# EasyEDA Pro project ProPrj_雁过留痕_2026-07-08.epro, schematic 

## Sheets
1 主控: Board Name: Board1; Create Date: 2025-12-18; Page Name: P1; Project Name: 雁过留痕第二版; Schematic Name: Schematic1; Update Date: 2025-12-22; Company: 嘉立创EDA; Page Size: A4; Version: V1.0
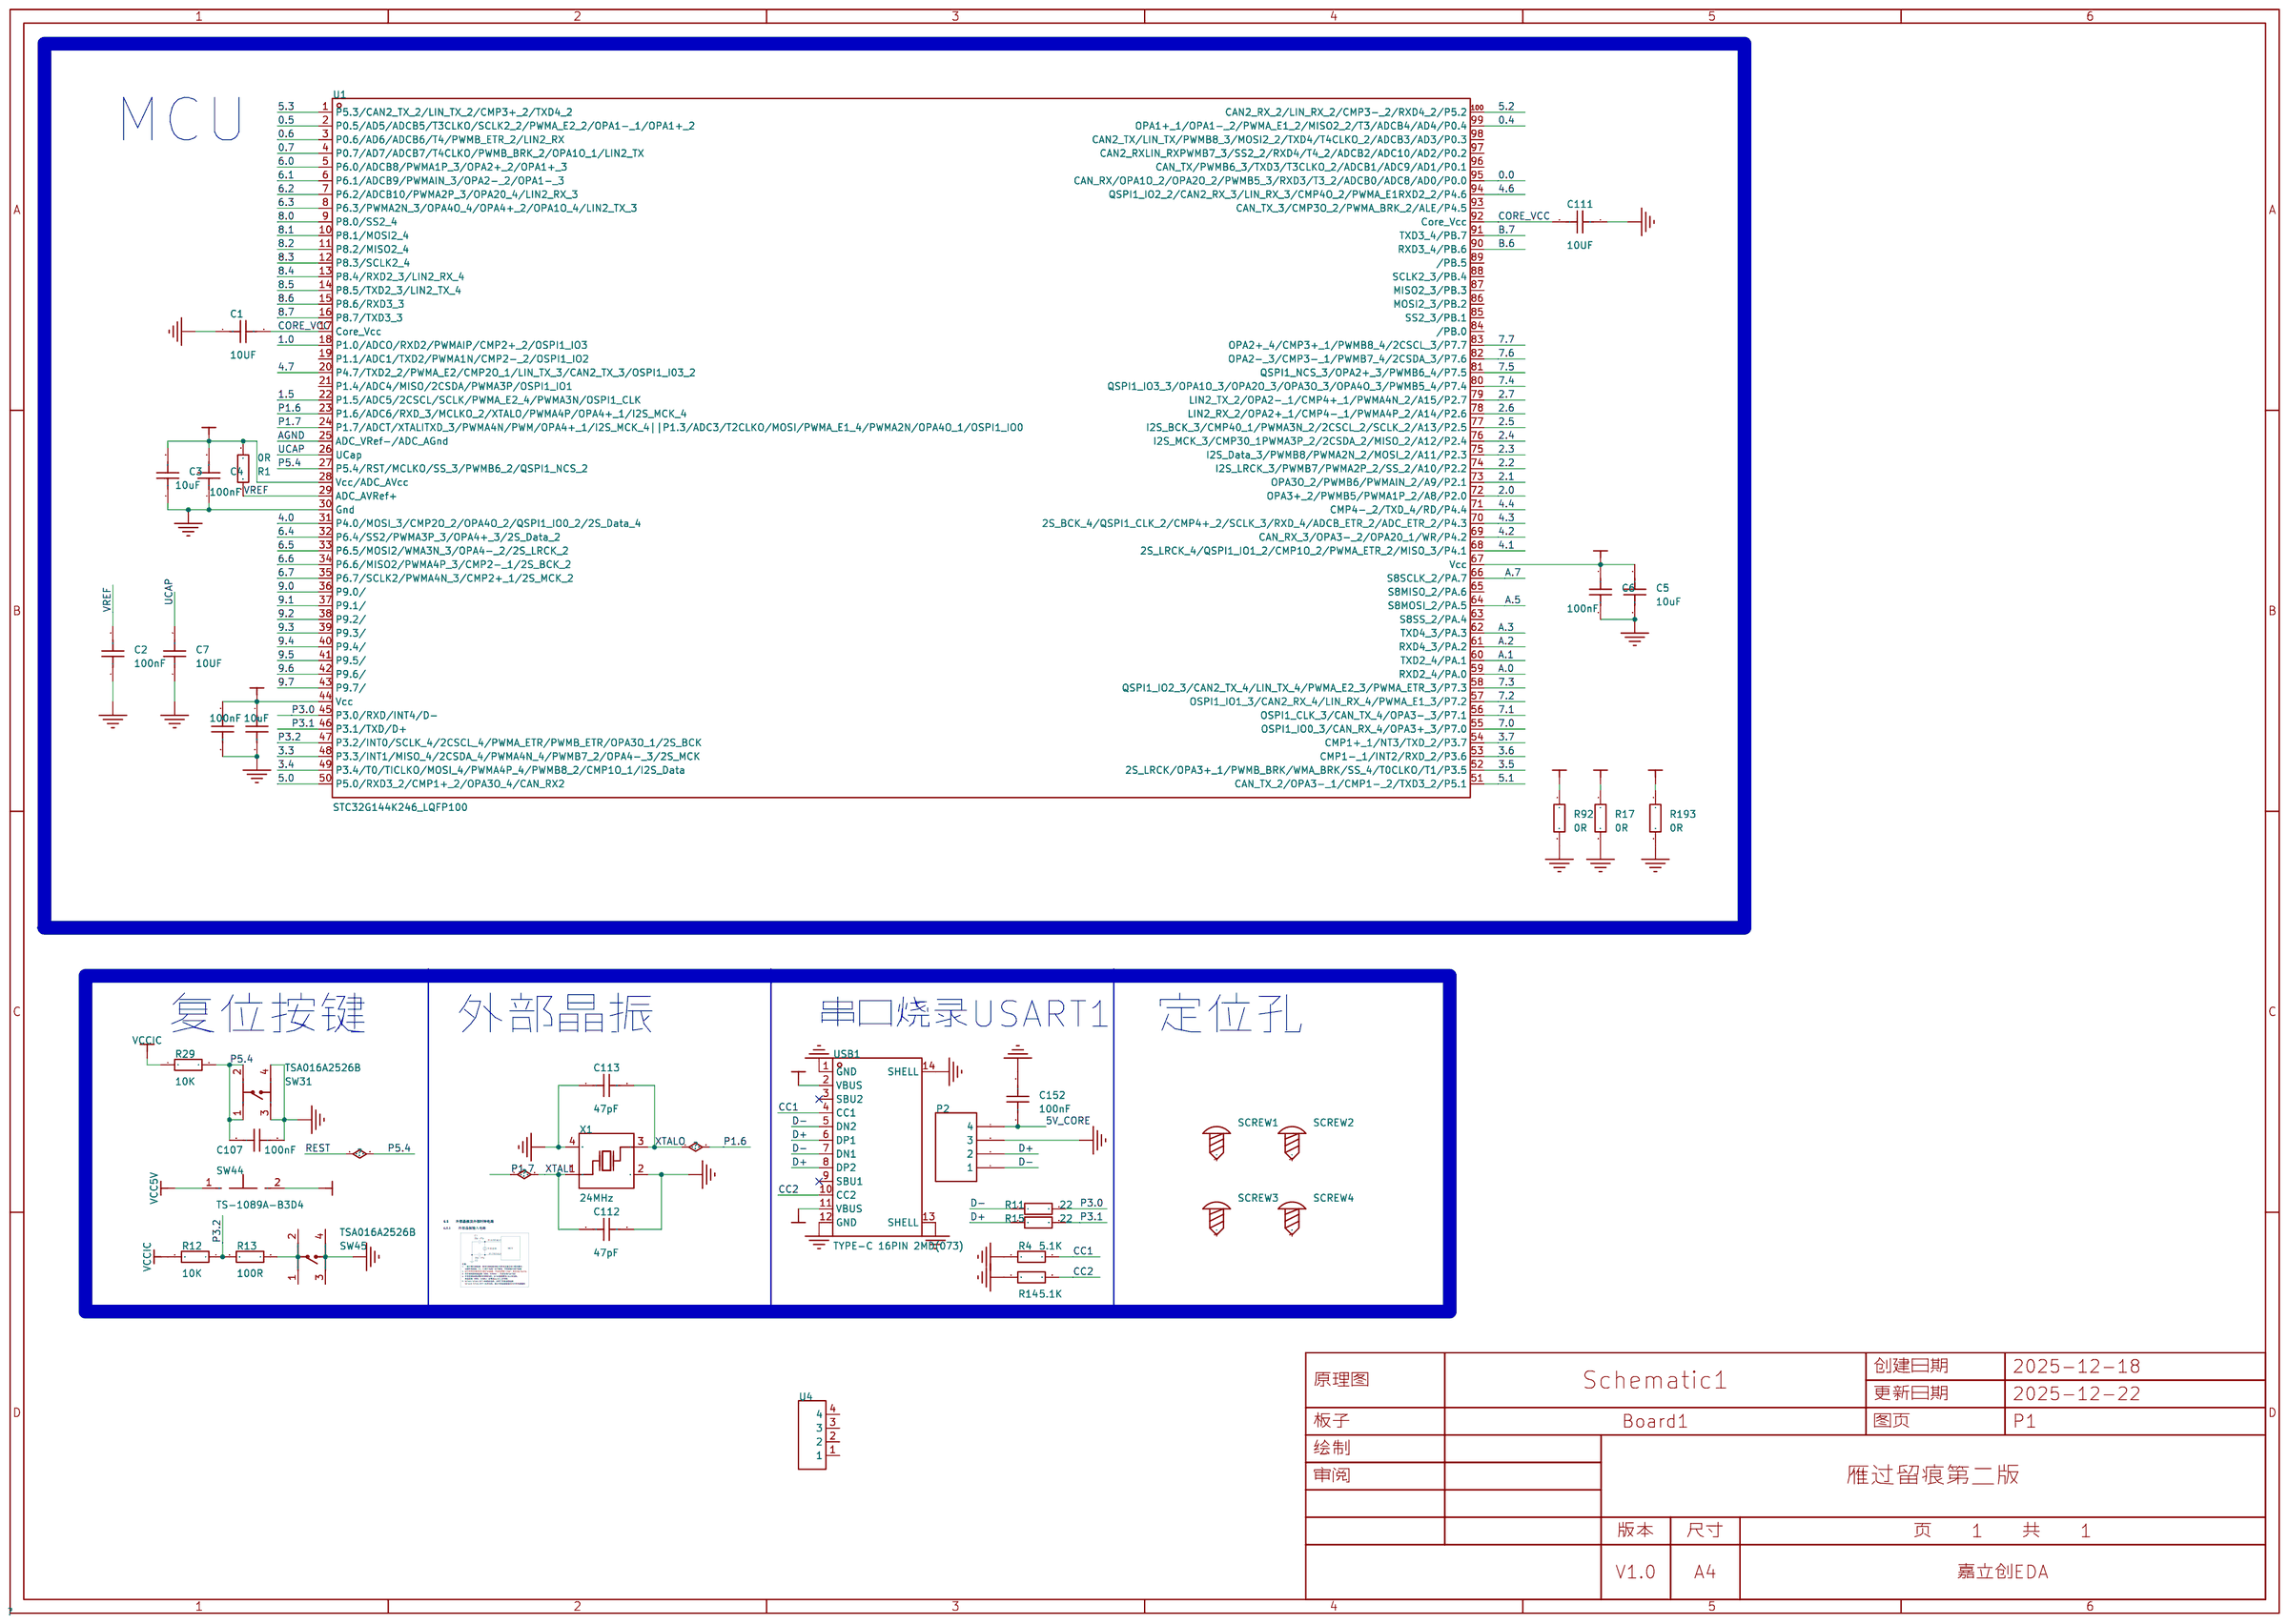
[diagram p0: 主控]
2 电源: Assembly Variant: Basic; Create Date: 2026-03-18; Page Name: P2; Project Name: 雁过留痕主驱一体_逐飞库; Update Date: 2026-03-18
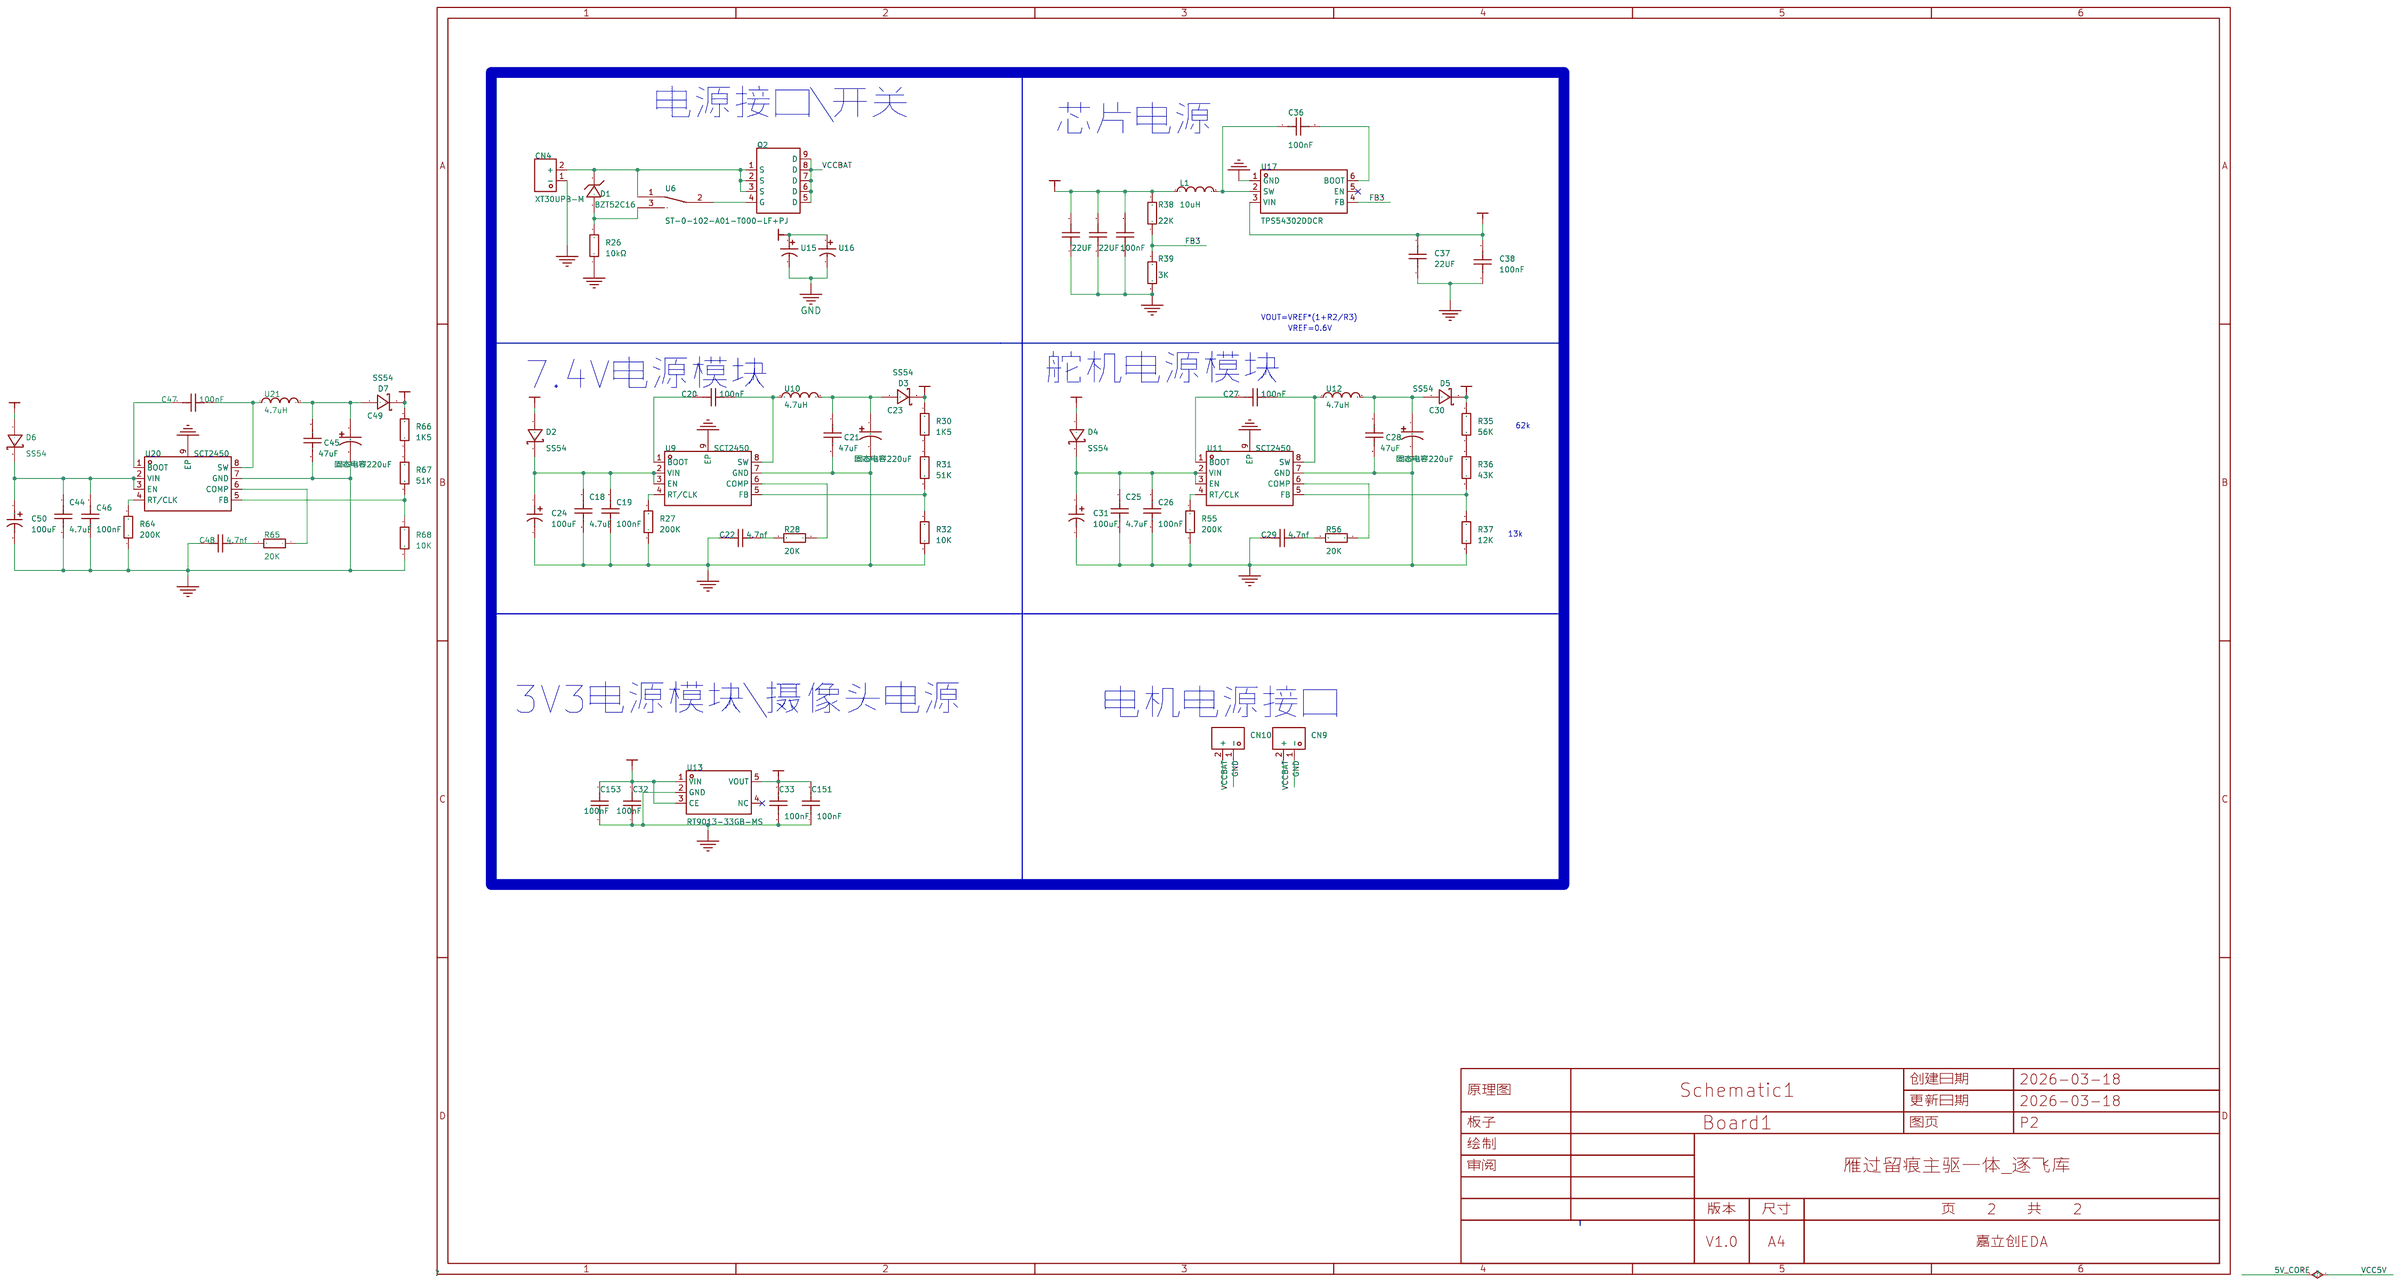
[diagram p1: 电源]
3 外设1: Assembly Variant: Basic; Create Date: 2026-03-18; Page Name: P3; Project Name: 雁过留痕主驱一体_逐飞库; Update Date: 2026-03-18
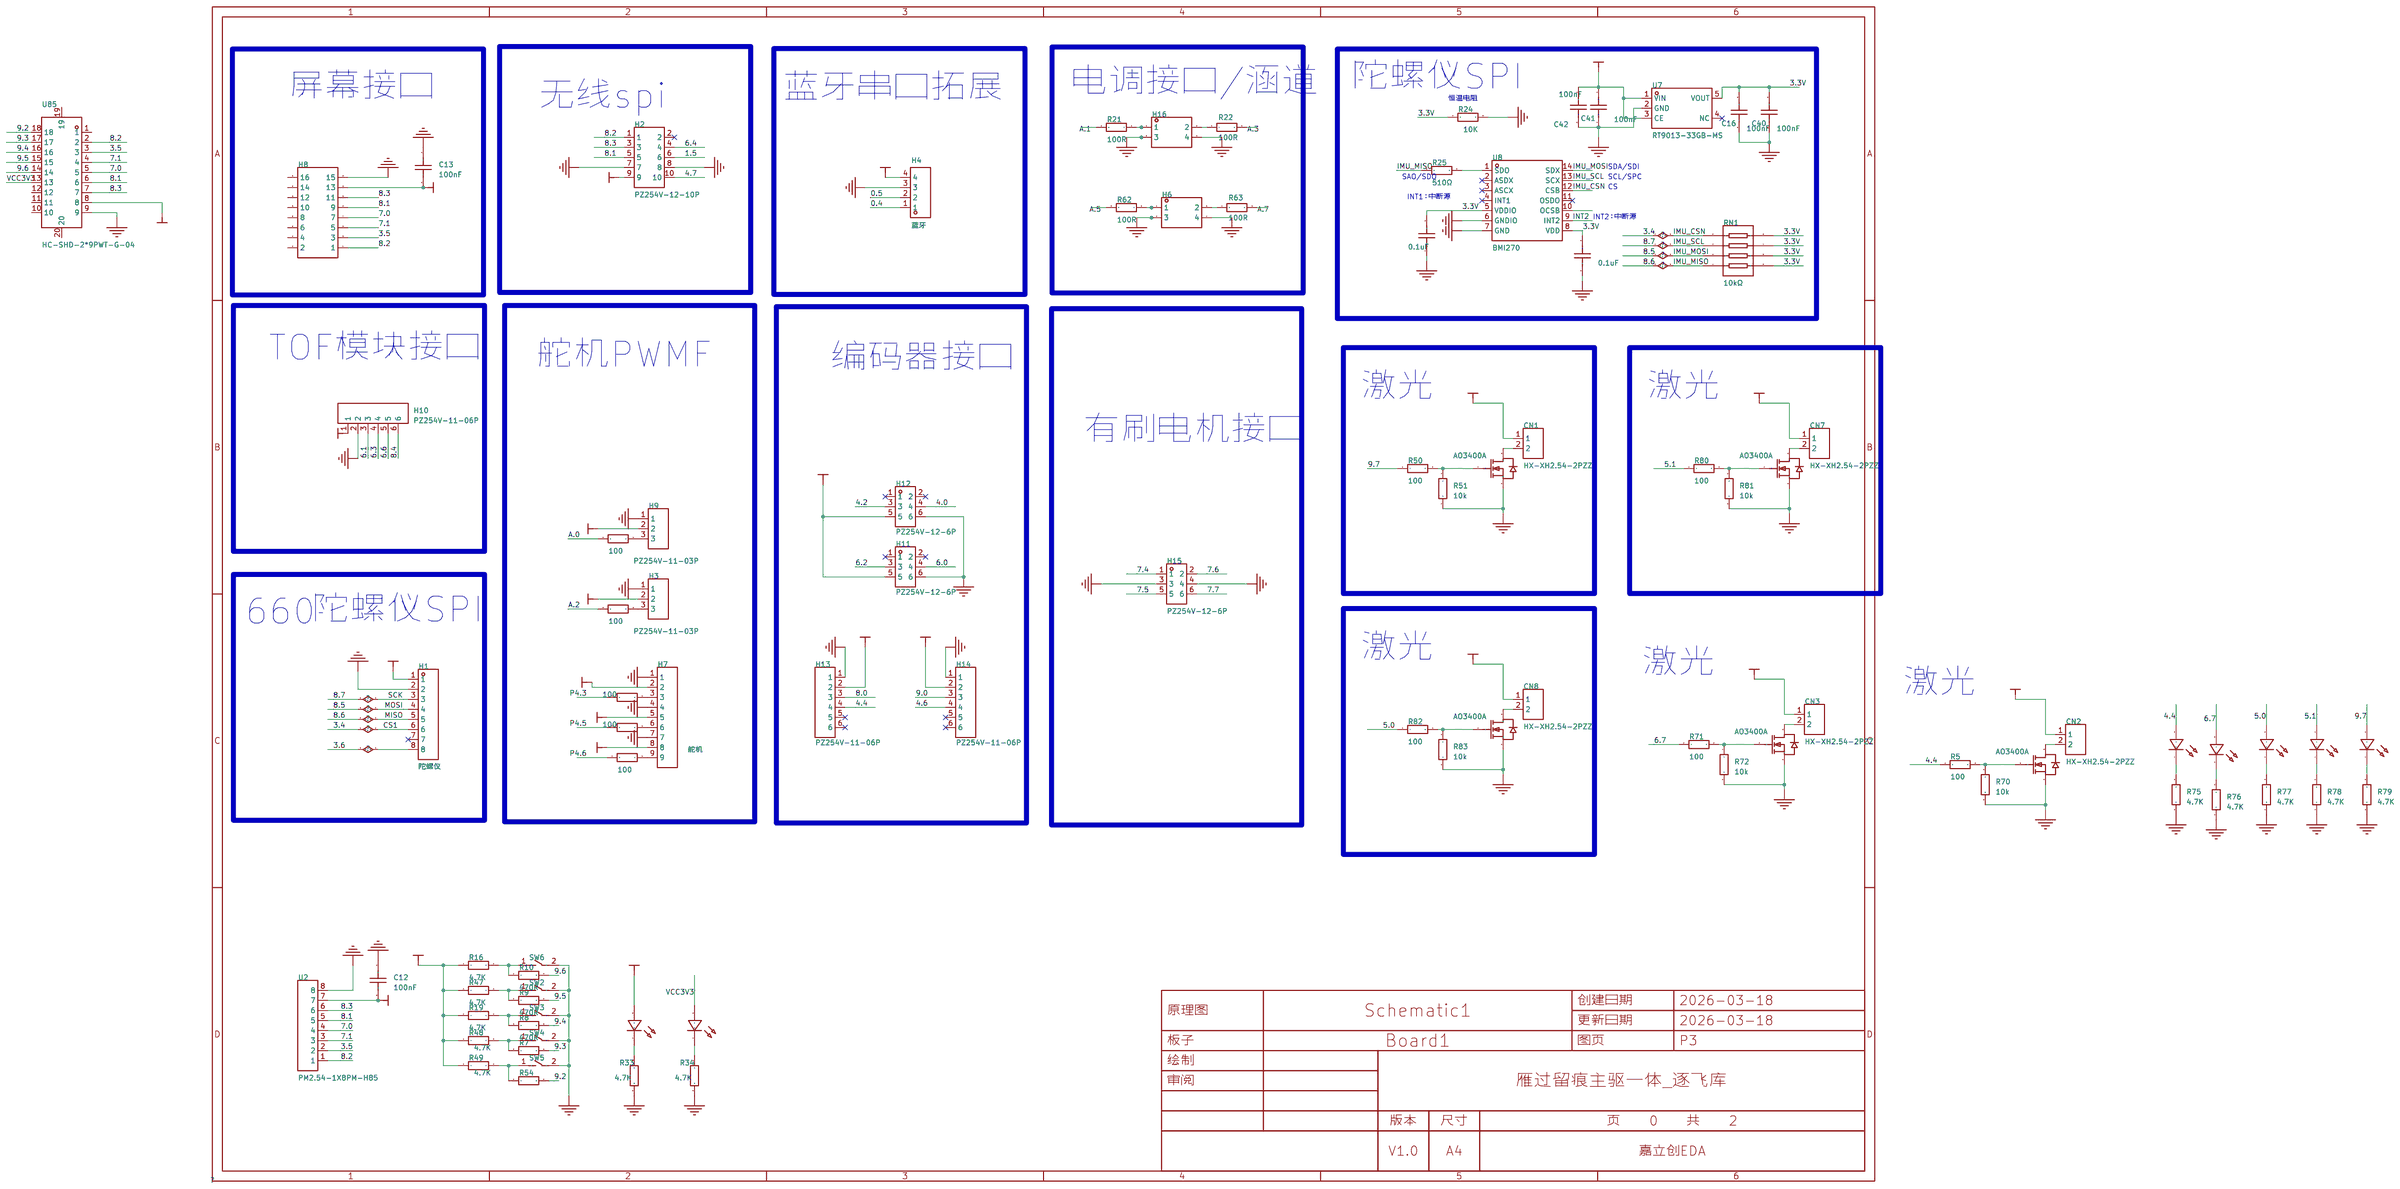
[diagram p2: 外设1]
4 外设2: Assembly Variant: Basic; Create Date: 2026-03-18; Page Name: P4; Project Name: 雁过留痕主驱一体_逐飞库; Update Date: 2026-03-18
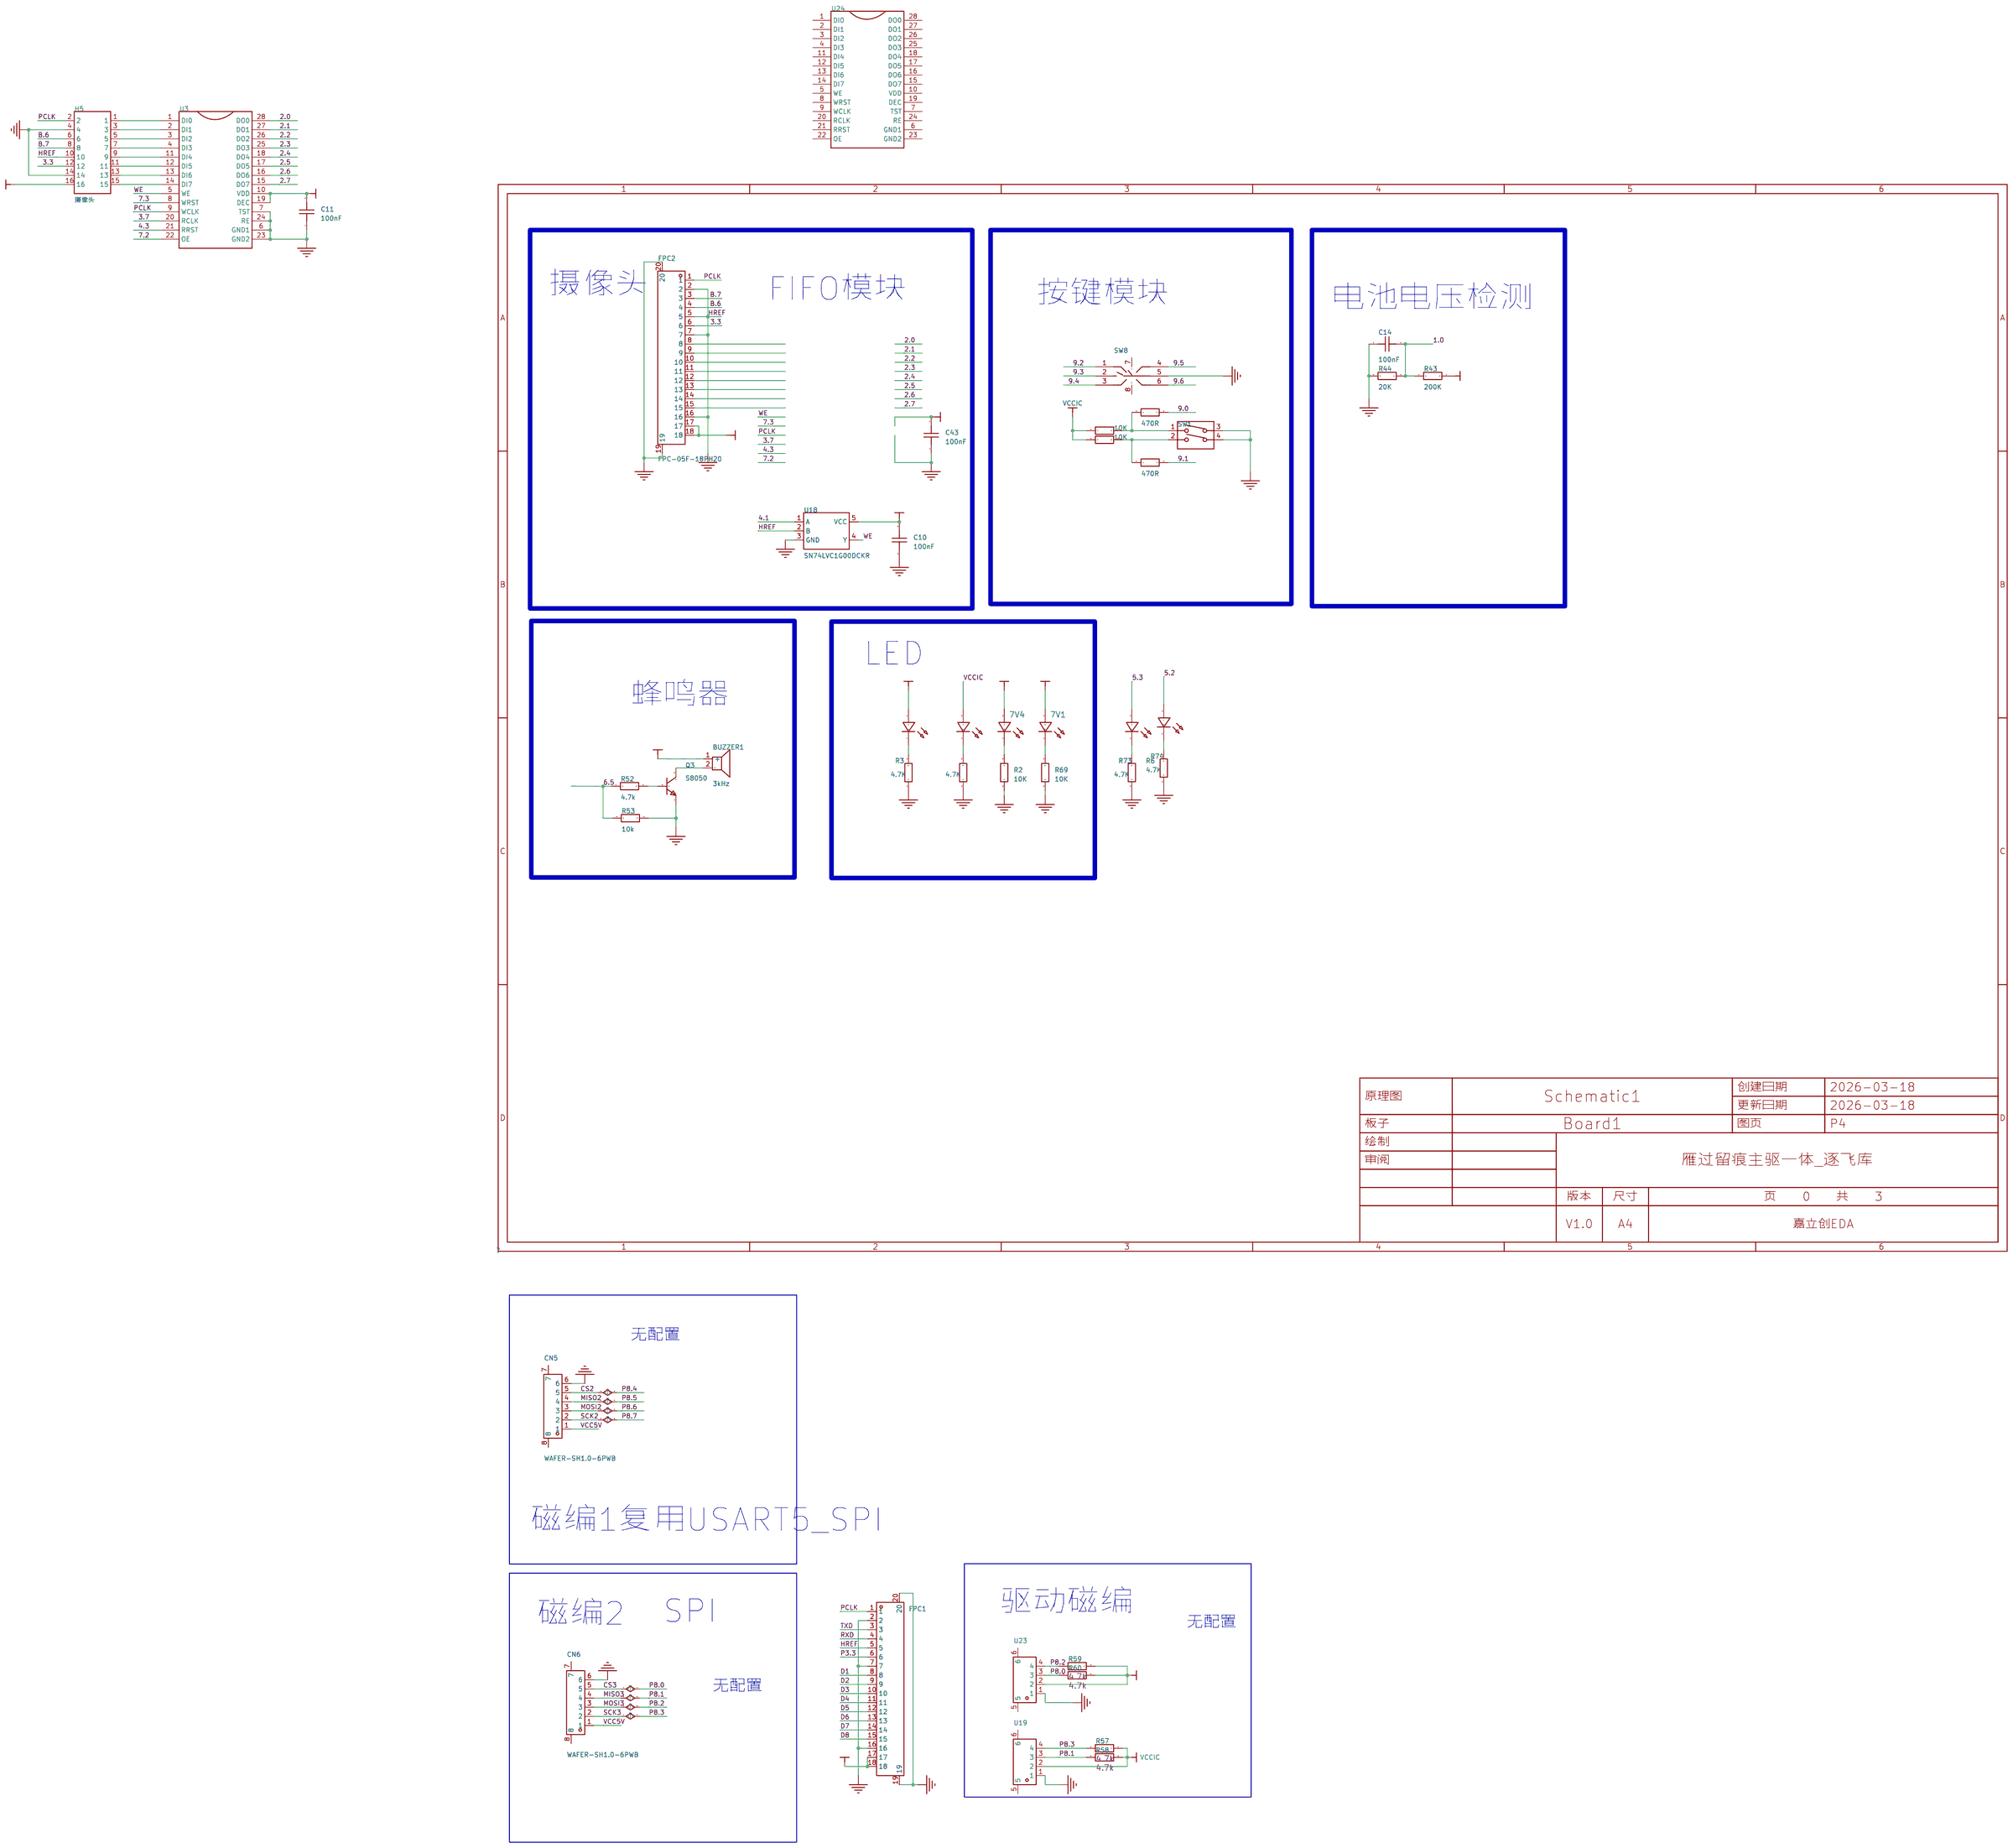
[diagram p3: 外设2]

## Parts
sheet 主控
C1  10UF  [C0603]
C2  100nF  [C0603]
C3  10uF  [C0603]
C4  100nF  [C0603]
C5  10uF  [C0603]
C6  100nF  [C0603]
C7  10UF  [C0603]
C8  10uF  [C0603]
C9  100nF  [C0603]
C107  100nF  [C0603_2]
C111  10UF  [C0603]
C112  100nF  [C0603_1]
C113  100nF  [C0603_1]
C152  100nF  [C0603_1]
P2  Header-D-M 1x4P  [HDR1X4-TP]
R1  0R  [R0603_3]
R4  10K  [R0603_9]
R11  22  [R0603]
R12  10K  [R0603_6]
R13  100R  [R0603_6]
R14  10K  [R0603_9]
R15  22  [R0603]
R17  0R  [R0603_3]
R29  10K  [R0603_5]
R92  0R  [R0603_3]
R193  0R  [R0603_3]
SCREW1  -  [M3螺丝]
SCREW2  -  [M3螺丝]
SCREW3  -  [M3螺丝]
SCREW4  -  [M3螺丝]
SW31  TSA016A2526B  [KEY-SMD_4P-L4.2-W3.4-P2.15-LS4.5-TL]
SW44  TS-1089A-B3D4  [KEY-SMD_2P-L6.0-W3.8-LS7.30-L]
SW45  TSA016A2526B  [KEY-SMD_4P-L4.2-W3.4-P2.15-LS4.5-TL]
U1  STC32G144K246_LQFP100  [STC32G144K246LQFP-100(16x16)]
U4  HX PZ2.54-1x4P WZ  [HDR-TH_4P-P2.54-H-M-W10.3]
USB1  TYPE-C 16PIN 2MD(073)  [USB-C-SMD_TYPE-C-6PIN-2MD-073]
X1  24MHz  [CRYSTAL-SMD_4P-L3.2-W2.5-BL]
sheet 外设1
3V2  -  [LED_0805]
3V3  -  [LED_0805]
3V4  -  [LED_0805]
3V5  -  [LED_0805]
3V6  -  [LED_0805]
3V7  -  [LED_0805]
3V8  -  [LED_0805]
C12  100nF  [C0603]
C13  100nF  [C0603]
C15  0.1uF  [C0402_3]
C16  100nF  [C0402_3]
C17  0.1uF  [C0402_3]
C40  100nF  [C0402_3]
C41  100nF  [C0402_3]
C42  100nF  [C0402_3]
CN1  HX-XH2.54-2PZZ  [CONN-TH_2P-P2.50_HX-2.54MM-2P-ZZ-MS]
CN2  HX-XH2.54-2PZZ  [CONN-TH_2P-P2.50_HX-2.54MM-2P-ZZ-MS]
CN3  HX-XH2.54-2PZZ  [CONN-TH_2P-P2.50_HX-2.54MM-2P-ZZ-MS]
CN7  HX-XH2.54-2PZZ  [CONN-TH_2P-P2.50_HX-2.54MM-2P-ZZ-MS]
CN8  HX-XH2.54-2PZZ  [CONN-TH_2P-P2.50_HX-2.54MM-2P-ZZ-MS]
H1  陀螺仪  [HDR-TH_8P-P2.54-V-M]
H2  PZ254V-12-10P  [HDR-TH_10P-P2.54-V-M-R2-C5-S2.54]
H3  PZ254V-11-03P  [HDR-TH_3P-P2.54-V-M_PZ254V-11-03P]
H4  蓝牙  [HDR-TH_4P-P2.54-V-M]
H6  -  [HDR-TH_4P-P2.54-V-F-R2-C2-S2.54]
H7  舵机  [HDR-TH_9P-P2.54-V-M-R3-C3]
H8  -  [HDR-TH_16P-P2.54-V-F-R2-C8-S2.54-1]
H9  PZ254V-11-03P  [HDR-TH_3P-P2.54-V-M_PZ254V-11-03P]
H10  PZ254V-11-06P  [HDR-TH_6P-P2.54-V-M]
H11  PZ254V-12-6P  [HDR-TH_6P-P2.54-V-M-R2-C3-S2.54_1]
H12  PZ254V-12-6P  [HDR-TH_6P-P2.54-V-M-R2-C3-S2.54_1]
H13  PZ254V-11-06P  [HDR-TH_6P-P2.54-V-M]
H14  PZ254V-11-06P  [HDR-TH_6P-P2.54-V-M]
H15  PZ254V-12-6P  [HDR-TH_6P-P2.54-V-M-R2-C3-S2.54_1]
H16  -  [HDR-TH_4P-P2.54-V-F-R2-C2-S2.54]
Q1  AO3400A  [SOT-23-3_L2.9-W1.3-P1.90-LS2.4-BR]
Q4  AO3400A  [SOT-23-3_L2.9-W1.3-P1.90-LS2.4-BR]
Q5  AO3400A  [SOT-23-3_L2.9-W1.3-P1.90-LS2.4-BR]
Q6  AO3400A  [SOT-23-3_L2.9-W1.3-P1.90-LS2.4-BR]
Q7  AO3400A  [SOT-23-3_L2.9-W1.3-P1.90-LS2.4-BR]
R5  10K  [R0603]
R7  470R  [R0603]
R8  470R  [R0603]
R9  470R  [R0603]
R10  470R  [R0603]
R16  4.7K  [R0603]
R18  100  [R0603]
R19  4.7K  [R0603]
R20  100  [R0603_2]
R21  100R  [R0603]
R22  100R  [R0603]
R24  10K  [R0603_4]
R25  510Ω  [R0201]
R33  10K  [R0603_9]
R34  10K  [R0603_9]
R45  100  [R0603]
R46  100  [R0603]
R47  4.7K  [R0603]
R48  4.7K  [R0603]
R49  4.7K  [R0603]
R50  10K  [R0603]
R51  10k  [R0603_2]
R54  470R  [R0603]
R61  100  [R0603]
R62  100R  [R0603]
R63  100R  [R0603]
R70  10k  [R0603_2]
R71  10K  [R0603]
R72  10k  [R0603_2]
R75  10K  [R0603_9]
R76  10K  [R0603_9]
R77  10K  [R0603_9]
R78  10K  [R0603_9]
R79  10K  [R0603_9]
R80  10K  [R0603]
R81  10k  [R0603_2]
R82  10K  [R0603]
R83  10k  [R0603_2]
RN1  10kΩ  [RES-ARRAY-SMD_0402-8P-L2.0-W1.0-BL]
SW2  TSB06341-050W811WA-R1000  [SW-SMD_L6.0-W6.0-LS6.6]
SW3  TSB06341-050W811WA-R1000  [SW-SMD_L6.0-W6.0-LS6.6]
SW4  TSB06341-050W811WA-R1000  [SW-SMD_L6.0-W6.0-LS6.6]
SW5  TSB06341-050W811WA-R1000  [SW-SMD_L6.0-W6.0-LS6.6]
SW6  TSB06341-050W811WA-R1000  [SW-SMD_L6.0-W6.0-LS6.6]
U2  PM2.54-1X8PM-H85  [HDR-TH_8P-P2.54-V-F]
U7  RT9013-33GB-MS  [SOT-23-5_L2.9-W1.6-P0.95-LS2.8-BR_1]
U8  BMI270  [LGA-14_L3.0-W2.5-P0.50-BR]
U85  HC-SHD-2*9PWT-G-04  [CONN-SMD_HC-SHD-2-9PWT-G-04]
sheet 外设2
3V1  -  [LED_0805]
7V1  -  [LED_0805]
7V4  -  [LED_0805]
9.1  -  [LED_0805]
9.7  -  [LED_0805]
BUZZER1  3kHz  [BUZ-TH_BD9.6-P5.00-D0.7-FD]
C10  100nF  [C0603]
C11  100nF  [C0603_5]
C14  100nF  [C0603_1]
C43  100nF  [C0603_5]
CN5  WAFER-SH1.0-6PWB  [CONN-SMD_6P-P1.00_XUNPU_WAFER-SH1.0-6PWB]
CN6  WAFER-SH1.0-6PWB  [CONN-SMD_6P-P1.00_XUNPU_WAFER-SH1.0-6PWB]
FPC1  FPC-05F-18PH20  [FPC-SMD_18P-P0.50_FPC-05F-18PH20]
FPC2  FPC-05F-18PH20  [FPC-SMD_18P-P0.50_FPC-05F-18PH20]
H5  摄像头  [HDR-TH_16P-P2.54-V-M-R2-C8-S2.54]
Q3  S8050  [SOT-23-3_L3.0-W1.7-P0.95-LS2.9-BR]
R2  10K  [R0603]
R3  10K  [R0603_9]
R6  10K  [R0603_9]
R23  10K  [R0603]
R40  10K  [R0603]
R41  10K  [R0603]
R42  10K  [R0603]
R43  200K  [R0603]
R44  20K  [R0603]
R52  10K  [R0603]
R53  10k  [R0603_2]
R57  1kΩ  [R0603_1]
R58  1kΩ  [R0603_1]
R59  1kΩ  [R0603_1]
R60  1kΩ  [R0603_1]
R69  10K  [R0603]
R73  10K  [R0603_9]
R74  10K  [R0603_9]
SW1  DSWB02LHGET  [SW-TH_DSWB02LHGET]
SW8  KAN0741-0601M1  [KEY-SMD_KAN0741-0601M1]
U3  -  [SOP-28_L17.9-W7.1-P1.27-LS10.3-BL]
U18  SN74LVC1G00DCKR  [SOT-353_L2.1-W1.3-P0.65-LS2.3-BR]
U19  1.25-4PWB  [CONN-SMD_1.25-4PWB]
U23  1.25-4PWB  [CONN-SMD_1.25-4PWB]
U24  -  [SOP-28_L17.9-W7.1-P1.27-LS10.3-BL]
芯片1  -  [LED_0805]
sheet 电源
C18  4.7uF  [C1206]
C19  100nF  [C0603_3]
C20  100nF  [C0603_3]
C21  47uF  [C1206]
C22  4.7nf  [C0603_3]
C23  固态电容220uF  [CAP-TH_BD6.3-P2.50-D1.0-FD]
C24  100uF  [CAP-TH_BD6.3-P2.50-D0.5-FD_NPXC0571C101MF]
C25  4.7uF  [C1206]
C26  100nF  [C0603_3]
C27  100nF  [C0603_3]
C28  47uF  [C1206]
C29  4.7nf  [C0603_3]
C30  固态电容220uF  [CAP-TH_BD6.3-P2.50-D1.0-FD]
C31  100uF  [CAP-TH_BD6.3-P2.50-D0.5-FD_NPXC0571C101MF]
C32  100nF  [C0603_3]
C33  100nF  [C0603_3]
C34  22UF  [C0603_1]
C35  100nF  [C0603_1]
C36  100nF  [C0603_1]
C37  100nF  [C0603_4]
C38  100nF  [C0603_4]
C39  100nF  [C0603_1]
C44  4.7uF  [C1206]
C45  47uF  [C1206]
C46  100nF  [C0603_3]
C47  100nF  [C0603_3]
C48  4.7nf  [C0603_3]
C49  固态电容220uF  [CAP-TH_BD6.3-P2.50-D1.0-FD]
C50  100uF  [CAP-TH_BD6.3-P2.50-D0.5-FD_NPXC0571C101MF]
C151  100nF  [C0603_3]
C153  100nF  [C0603_3]
CN4  XT30UPB-M  [CONN-TH_XT30UPB-M]
CN9  XT30UPB-M  [CONN-TH_XT30UPB-M]
CN10  XT30UPB-M  [CONN-TH_XT30UPB-M]
D1  BZT52C16  [SOD-123_L2.7-W1.6-LS3.7-RD]
D2  SS54  [SMA_L4.4-W2.8-LS5.4-R-RD]
D3  SS54  [SMA_L4.4-W2.8-LS5.4-R-RD]
D4  SS54  [SMA_L4.4-W2.8-LS5.4-R-RD]
D5  SS54  [SMA_L4.4-W2.8-LS5.4-R-RD]
D6  SS54  [SMA_L4.4-W2.8-LS5.4-R-RD]
D7  SS54  [SMA_L4.4-W2.8-LS5.4-R-RD]
L1  10uH  [IND-SMD_L5.4-W5.2_FXL0530_1]
Q2  AGM30P100A  [PDFN-8_L5.8-W4.9-P1.27-LS6.1-BL-A]
R26  10kΩ  [R0603_8]
R27  200K  [R0603]
R28  20K  [R0603]
R30  1K5  [R0603]
R31  51K  [R0603]
R32  10K  [R0603]
R35  56K  [R0603]
R36  43K  [R0603]
R37  12K  [R0603]
R38  22K  [R0603]
R39  3K  [R0603]
R55  200K  [R0603]
R56  20K  [R0603]
R64  200K  [R0603]
R65  20K  [R0603]
R66  1K5  [R0603]
R67  51K  [R0603]
R68  10K  [R0603]
U6  ST-0-102-A01-T000-LF+PJ  [SW-TH_3P-L8.3-W5.2-P2.54_ST-0-102-A01-T000]
U9  SCT2450  [ESOP-8_L4.9-W3.9-P1.27-LS6.0-BL-EP]
U10  4.7uH  [IND-SMD_L5.4-W5.2_FXL0530]
U11  SCT2450  [ESOP-8_L4.9-W3.9-P1.27-LS6.0-BL-EP]
U12  4.7uH  [IND-SMD_L5.4-W5.2_FXL0530]
U13  RT9013-33GB-MS  [SOT-23-5_L2.9-W1.6-P0.95-LS2.8-BR]
U15  470uF  [CAP-TH_BD8.0-P3.50-D0.6-FD]
U16  470uF  [CAP-TH_BD8.0-P3.50-D0.6-FD]
U17  TPS54302DDCR  [SOT-23-6_L2.9-W1.6-P0.95-LS2.8-BL]
U20  SCT2450  [ESOP-8_L4.9-W3.9-P1.27-LS6.0-BL-EP]
U21  4.7uH  [IND-SMD_L5.4-W5.2_FXL0530]

## Library data of the parts
C1-C10 C12 C13 C111 = CAP_0603: Supplier Footprint: 0603
C107 = CL10A226MQ8NRNC: 容值:22uF;精度:±20%;额定电压:6.3V;材质(温度系数):X5R;; LCSC Part Name: 22uF ±20% 6.3V; Supplier Part: C59461; Manufacturer: SAMSUNG(三星); Supplier Footprint: 0603; JLCPCB Part Class: Basic Part; Datasheet: https://atta.szlcsc.com/upload/public/pdf/source/20160103/1457707740762.pdf; Supplier: LCSC; Tolerance: ±20%; Voltage Rated: 6.3V; Temperature Coefficient: X5R
C14 C34-C36 C39 C112 C113 C152 = CAP_605: Supplier Footprint: 0603
P2 = Header-D-M 1x4P: 1x4pin; Revision: V1.0; Library Name: 无刷驱动-STC-无感-Lite3S
R1 R17 R92 R193 = Res_607: Supplier Footprint: 0603
R3 R4 R6-R11 R14-R16 R19 R33 R34 R47-R49 R54 R73-R79 = Res_0603: Supplier Footprint: 0603
R12 R13 = Res_605: Supplier Footprint: 0603
R29 = 0603WAF3000T5E: 精度:±1%;阻值:300Ω;温度系数:±100ppm/;功率:1/10W;最大工作电压:75V;工作温度范围:-55~+155;; LCSC Part Name: 300Ω ±1%; Supplier Part: C23025; Manufacturer: UNI-ROYAL(厚声); Supplier Footprint: 0603; JLCPCB Part Class: Basic Part; Datasheet: https://atta.szlcsc.com/upload/public/pdf/source/20170920/C23025_1505901039318982412.pdf; Supplier: LCSC; Tolerance: ±1%; Temperature Coefficient: ±100ppm/; Power(Watts): 1/10W; Overload Voltage (Max): 75V; Operating Temperature Range: -55~+155
SCREW1-SCREW4 = M3螺丝: Supplier Footprint: 插件
SW31 SW45 = TSA016A2526B: 按钮形状:椭圆形按钮;作用力:260gf;安装方式:立贴;开关长度:4.2mm;开关宽度:3.35mm;开关高度:2.5mm;触点电流:50mA;额定电压(AC):-;额定电压(DC):12V;机械寿命:-;; LCSC Part Name: 4.2*3.35*2.5mm 立贴 轻触开关; Supplier Part: C2888429; Manufacturer: BZCN(博众电气); Supplier Footprint: SMD; JLCPCB Part Class: 扩展库; Datasheet: https://atta.szlcsc.com/upload/public/pdf/source/20210906/0198B859780D4FA617E4EB862D7350E5.pdf; Supplier: LCSC; Actuator Style: 椭圆形按钮; Operating Force: 260gf; Mounting Style: 立贴; Switch Length: 4.2mm; Switch Width: 3.35mm; Switch Height: 2.5mm; Contact Current: 50mA; Voltage Rating (DC): 12V; Actuator/Cap Color: 白色
SW44 = TS-1089A-B3D4: 电路结构:单刀单掷;按钮形状:圆形按钮;安装方式:-;开关长度:6mm;开关宽度:3.65mm;开关高度:2.6mm;带灯:-;机械寿命:-;; LCSC Part Name: 轻触开关6.0*3.65*2.6常闭式硅胶圆蓝柄250gf; Supplier Part: C498305; Manufacturer: Yuandi(元迪); Supplier Footprint: SMD,3.7x6mm; JLCPCB Part Class: 扩展库; Datasheet: https://atta.szlcsc.com/upload/public/pdf/source/20200318/C498305_E1D5433E42700991680A097C7C5FB391.pdf; Supplier: LCSC; Circuit: 单刀单掷; Actuator Style: 圆形按钮; Switch Length: 6mm; Switch Width: 3.65mm; Switch Height: 2.6mm
U1 = STC32G144K256-LQFP(16x16)
U4 = HX PZ2.54-1x4P WZ: LCSC Part Name: 1x4P 间距:2.54mm 方针 弯插; Supplier Part: C32713263; Manufacturer: hanxia(韩下); Supplier Footprint: 弯插,P=2.54mm; JLCPCB Part Class: Extended Part; Datasheet: https://item.szlcsc.com/datasheet/HX%2520PZ2.54-1x4P%2520WZ/34444543.html; Supplier: LCSC; Pin Structure: 1x4P; Pitch: 2.54mm; Circluar Pins/Square Pins: 方针; Mounting Type: 弯插; Number of Rows: 单排; Number of Pins: 4P; Current Rating: 3A; Voltage Rating (Max): 1kV; Length of Mating Pin: 6mm; Insulation Height: 2.5mm; Length of End Connection Pin: 3mm; Contact Material: 黄铜; Contact Plating: 金; Operating Temperature: -40℃~+105℃; Color: 黑色
USB1 = TYPE-C 16PIN 2MD(073): LCSC Part Name: Type-C 母 卧贴; Supplier Part: C2765186; Manufacturer: SHOU HAN(首韩); Supplier Footprint: SMD; JLCPCB Part Class: Extended Part; Datasheet: https://item.szlcsc.com/datasheet/TYPE-C%252016PIN%25202MD(073)/2901843.html; Supplier: LCSC; Connector Type: Type-C; Gender: 母; Mounting Type: 卧贴; Number of Contacts: 16P; Number of Ports: 1; Current Rating-Power: 3A; Voltage Rating: 5V; Connect-Disconnect Life: 5千次; Detection color: 黑色; Operating Temperature: -25℃~+85℃
X1 = X322524MSB4SI: 晶振类型:贴片晶振;频率:24MHz;常温频差:±10ppm;负载电容:20pF;频率稳定度:±20ppm;; LCSC Part Name: YSX321SL 24MHZ 4P 3225 20PF ±10PPM -40~85℃ (±20PPM); Supplier Part: C15643; Manufacturer: YXC(扬兴晶振); Supplier Footprint: SMD3225-4P; JLCPCB Part Class: 扩展库; Datasheet: https://item.szlcsc.com/datasheet/X322524MSB4SI/16324.html; Supplier: LCSC; Type: 贴片晶振; Normal temperature Frequency Tolerance: ±10ppm; Load Capacitance: 20pF; Frequency Stability: ±20ppm; Operating Temperature: -40℃~+85℃
3V1-3V8 7V1 7V4 9.1 9.7 芯片1 = LED_0805-R: Supplier Footprint: 0805
C15-C17 C40-C42 = CAP_606: Supplier Footprint: 0603
CN1-CN3 CN7 CN8 = HX-XH2.54-2PZZ: 插针结构:1x2P;间距:2.54mm;安装方式:直插;参考系列:XH;总PIN数:2P;排数:1;每排PIN数:2;行距:-;额定电流:3A;触头材质:黄铜;触头镀层:锡;工作温度:-25℃~+85℃;; LCSC Part Name: 1x2P 间距:2.5mm 直插 系列:XH; Supplier Part: C42391660; Manufacturer: hanxia(韩下); Supplier Footprint: 插件,P=2.5mm; JLCPCB Part Class: Extended Part; Datasheet: https://item.szlcsc.com/datasheet/HX-XH2.54-2PZZ/44326932.html; Supplier: LCSC; Pins Structure: 1x2P; Pitch: 2.54mm; Mounting Type: 直插; Reference Series: XH; Number of Pins: 2P; Number of Rows: 1; Number of PINs Per Row: 2; Current Rating: 3A; Contact Material: 黄铜; Contact Plating: 锡; Operating Temperature: -25℃~+85℃; Voltage Rating: 250V; Plastic Material: PA66; Flame Retardant Rating: UL94V-0; Color: 白色
H1 = PZ254V-11-08P: 插针结构:1x8P;间距:2.54mm;行距:-;圆针/方针:方针;安装方式:直插;排数:单排;总PIN位数:8P;额定电流:-;额定电压:-;配合针长度:6mm;塑高:2.5mm;端接针长度:3mm;触头材质:黄铜;触头镀层:-;工作温度:-40℃~+105℃;颜色:黑色;; LCSC Part Name: 1x8P 间距:2.54mm 方针 直插; Supplier Part: C492407; Manufacturer: XFCN(兴飞); Supplier Footprint: 插件,P=2.54mm; JLCPCB Part Class: 扩展库; Datasheet: https://item.szlcsc.com/datasheet/PZ254V-11-08P/502963.html; Supplier: LCSC; Pin Structure: 1x8P; Pitch: 2.54mm; Circluar Pins/Square Pins: 方针; Mounting Type: 直插; Number of Rows: 单排; Number of Pins: 8P; Length of Mating Pin: 6mm; Insulation Height: 2.5mm; Length of End Connection Pin: 3mm; Contact Material: 黄铜; Operating Temperature: -40℃~+105℃; Color: 黑色
H2 = PZ254V-12-10P: 插针结构:2x5P;间距:2.54mm;行距:2.54mm;圆针/方针:方针;安装方式:直插;排数:双排;总PIN位数:10P;额定电流:-;额定电压:-;配合针长度:6mm;塑高:2.5mm;端接针长度:3mm;触头材质:黄铜;触头镀层:-;工作温度:-40℃~+105℃;颜色:黑色;; LCSC Part Name: 2x5P 间距:2.54mm 方针 直插; Supplier Part: C492422; Manufacturer: XFCN(兴飞); Supplier Footprint: 插件,P=2.54mm; JLCPCB Part Class: Extended Part; Datasheet: https://item.szlcsc.com/datasheet/PZ254V-12-10P/502978.html; Supplier: LCSC; Pin Structure: 2x5P; Pitch: 2.54mm; Row Spacing: 2.54mm; Circluar Pins/Square Pins: 方针; Mounting Type: 直插; Number of Rows: 双排; Number of Pins: 10P; Length of Mating Pin: 6mm; Insulation Height: 2.5mm; Length of End Connection Pin: 3mm; Contact Material: 黄铜; Operating Temperature: -40℃~+105℃; Color: 黑色
H3 H9 = PZ254V-11-03P: 插针结构:1x3P;间距:2.54mm;行距:-;圆针/方针:方针;安装方式:直插;排数:单排;总PIN位数:3P;额定电流:3A;额定电压:250V;配合针长度:6mm;塑高:2.5mm;端接针长度:3mm;工作温度:-40℃~+105℃;颜色:黑色;; LCSC Part Name: 1x3P 间距:2.54mm 方针 直插; Supplier Part: C2937625; Manufacturer: XFCN(兴飞); Supplier Footprint: 插件,P=2.54mm; JLCPCB Part Class: Extended Part; Datasheet: https://item.szlcsc.com/datasheet/PZ254V-11-03P/3293280.html; Supplier: LCSC; Pin Structure: 1x3P; Pitch: 2.54mm; Circluar Pins/Square Pins: 方针; Mounting Type: 直插; Number of Rows: 单排; Number of Pins: 3P; Current Rating: 3A; Voltage Rating (Max): 250V; Length of Mating Pin: 6mm; Insulation Height: 2.5mm; Length of End Connection Pin: 3mm; Operating Temperature: -40℃~+105℃; Color: 黑色
H4 = PZ254V-11-04P: 插针结构:1x4P;间距:2.54mm;行距:-;圆针/方针:方针;安装方式:直插;排数:单排;总PIN位数:4P;额定电流:3A;额定电压:250V;配合针长度:6mm;塑高:2.5mm;端接针长度:3mm;触头材质:-;工作温度:-40℃~+105℃;颜色:黑色;; LCSC Part Name: 1x4P 间距:2.54mm 方针 直插; Supplier Part: C2691448; Manufacturer: XFCN(兴飞); Supplier Footprint: 插件,P=2.54mm; JLCPCB Part Class: 扩展库; Datasheet: https://item.szlcsc.com/datasheet/PZ254V-11-04P/2801085.html; Supplier: LCSC; Pin Structure: 1x4P; Pitch: 2.54mm; Circluar Pins/Square Pins: 方针; Mounting Type: 直插; Number of Rows: 单排; Number of Pins: 4P; Current Rating: 3A; Voltage Rating (Max): 250V; Length of Mating Pin: 6mm; Insulation Height: 2.5mm; Length of End Connection Pin: 3mm; Operating Temperature: -40℃~+105℃; Color: 黑色
H6 H16 = HDR-F_2.54_2x2: Supplier Part: C92273; Supplier Footprint: 插件
H7 = HX PZ2.54-3x3P ZZ: 插针结构:3x3P;间距:2.54mm;行距:2.54mm;圆针/方针:方针;安装方式:直插;排数:三排;总PIN位数:9P;额定电流:3A;额定电压:1kV;配合针长度:6mm;塑高:2.5mm;端接针长度:3mm;触头材质:黄铜;触头镀层:金;工作温度:-40℃~+105℃;颜色:黑色;; LCSC Part Name: 3x3P 间距:2.54mm 方针 直插; Supplier Part: C32713290; Manufacturer: hanxia(韩下); Supplier Footprint: 插件,P=2.54mm; JLCPCB Part Class: Extended Part; Datasheet: https://item.szlcsc.com/datasheet/HX%2520PZ2.54-3x3P%2520ZZ/34444570.html; Supplier: LCSC; Pin Structure: 3x3P; Pitch: 2.54mm; Row Spacing: 2.54mm; Circluar Pins/Square Pins: 方针; Mounting Type: 直插; Number of Rows: 三排; Number of Pins: 9P; Current Rating: 3A; Voltage Rating (Max): 1kV; Length of Mating Pin: 6mm; Insulation Height: 2.5mm; Length of End Connection Pin: 3mm; Contact Material: 黄铜; Contact Plating: 金; Operating Temperature: -40℃~+105℃; Color: 黑色
H8 = HDR-F_2.54_2x8: Supplier Part: C30734; Supplier Footprint: 插件
H10 H13 H14 = PZ254V-11-06P: 插针结构:1x6P;间距:2.54mm;行距:-;圆针/方针:方针;安装方式:直插;排数:单排;总PIN位数:6P;额定电流:3A;额定电压:250V;配合针长度:6mm;塑高:2.5mm;端接针长度:3mm;触头材质:黄铜;触头镀层:-;工作温度:-40℃~+105℃;颜色:黑色;; LCSC Part Name: 1x6P 间距:2.54mm 方针 直插; Supplier Part: C492405; Manufacturer: XFCN(兴飞); Supplier Footprint: 插件,P=2.54mm; JLCPCB Part Class: Extended Part; Datasheet: https://item.szlcsc.com/datasheet/PZ254V-11-06P/502961.html; Supplier: LCSC; Pin Structure: 1x6P; Pitch: 2.54mm; Circluar Pins/Square Pins: 方针; Mounting Type: 直插; Number of Rows: 单排; Number of Pins: 6P; Current Rating: 3A; Voltage Rating (Max): 250V; Length of Mating Pin: 6mm; Insulation Height: 2.5mm; Length of End Connection Pin: 3mm; Contact Material: 黄铜; Operating Temperature: -40℃~+105℃; Color: 黑色
H11 H12 H15 = PZ254V-12-6P_1: 插针结构:2x3P;间距:2.54mm;行距:2.54mm;圆针/方针:方针;安装类型:直插;排数:双排;总PIN位数:6P;额定电流:-;额定电压:-;配合针长度:6mm;塑高:2.5mm;端接针长度:3mm;触头材质:黄铜;触头镀层:-;工作温度范围:-40℃~+105℃;颜色:黑色;; LCSC Part Name: 间距:2.54mm 2x3P 直插 方针; Supplier Part: C492420; Manufacturer: XFCN(兴飞); Supplier Footprint: 插件,P=2.54mm; JLCPCB Part Class: Extended Part; Datasheet: https://atta.szlcsc.com/upload/public/pdf/source/20200309/C492420_BAECB307B001054C09D200388220EAE6.pdf; Supplier: LCSC; Pin Structure: 2x3P; Pitch: 2.54mm; Row Spacing: 2.54mm; Circluar Pins/Square Pins: 方针; Mounting Type: 直插; Number of Rows: 双排; Number of Pins: 6P; Length of Mating Pin: 6mm; Insulation Height: 2.5mm; Length of End Connection Pin: 3mm; Contact Material: 黄铜; Operating Temperature Range: -40℃~+105℃; Color: 黑色
Q1 Q4-Q7 = AO3400A_C20917: 数量:-;漏源电压(Vdss):30V;连续漏极电流(Id):-;导通电阻(RDS(on)):48mΩ@2.5V;耗散功率(Pd):-;阈值电压(Vgs(th)):1.45V@250uA;; LCSC Part Name: 1个N沟道 耐压:30V 电流:5.7A; Supplier Part: C20917; Manufacturer: AOS; Supplier Footprint: SOT-23-3L; JLCPCB Part Class: Basic Part; Datasheet: https://item.szlcsc.com/datasheet/AO3400A/21629.html; Supplier: LCSC; Drain to Source Voltage: 30V; RDS(on): 48mΩ@2.5V; Gate Threshold Voltage (Vgs(th)): 1.45V@250uA; Gate Charge(Qg): 7nC@10V; Input Capacitance(Ciss): 630pF@15V; Operating Temperature: -55℃~+150℃@(Tj); Type: N沟道
R2 R5 R18 R20-R23 R27 R28 R30-R32 R35-R46 R50-R53 R55 R56 R61-R72 R80-R83 = Res_604: Supplier Footprint: 0603
R24 = Res_606: Supplier Footprint: 0603
R25 = 0603WAF1003T5E: LCSC Part Name: 100kΩ±1%100mW; Supplier Part: C25803; Manufacturer: UNI-ROYAL(厚声); Supplier Footprint: 0603; JLCPCB Part Class: BasicPart; Datasheet: https://atta.szlcsc.com/upload/public/pdf/source/20200306/C422600_1E6D84923E4A46A82E41ADD87F860B5C.pdf; Supplier: LCSC; Type: 厚膜电阻; Tolerance: ±1%; Power(Watts): 100mW; Temperature Coefficient: ±100ppm/℃; Overload Voltage (Max): 75V; Operating Temperature Range: -55℃~+155℃
RN1 = 4D02WGJ0103TCE: LCSC Part Name: 10kΩ ±5%; Supplier Part: C25725; Manufacturer: UNI-ROYAL(厚声); Supplier Footprint: 0402x4; JLCPCB Part Class: 扩展库; Datasheet: https://atta.szlcsc.com/upload/public/pdf/source/20191224/C474318_2527498AE30E813171187CCD28401A71.pdf; Supplier: LCSC; Number of Resistors: 4; Tolerance: ±5%; Power(Watts): 62.5mW; Temperature Coefficient: ±200ppm/℃; Number of Pins: 8
SW2-SW6 = TSB06341-050W811WA-R1000: 6*6*5无声按键、260gf、黑色、每卷1000只; LCSC Part Name: 6*6*5无声轻触开关/无声按键260gf黑色; Supplier Part: C49174518; Manufacturer: Khon(康宏电子); Supplier Footprint: SMD,6x6mm; JLCPCB Part Class: Extended Part; Datasheet: https://item.szlcsc.com/datasheet/TSB06341-050W811WA-R1000/51568544.html; Supplier: LCSC
U2 = PM2.54-1X8PM-H85: 插孔结构:1x8P;间距:2.54mm;行距:-;圆孔/方孔:方孔;安装方式:直插;排数:单排;总孔位数:8P;额定电流:3A;额定电压:-;插孔方向:顶部;塑高:8.5mm;触头材质:-;触头镀层:金;工作温度:-40℃~+105℃;; LCSC Part Name: 1x8P 间距:2.54mm 直插; Supplier Part: C42431840; Manufacturer: JXTCONN(聚兴泰); Supplier Footprint: 插件,P=2.54mm; JLCPCB Part Class: Extended Part; Datasheet: https://item.szlcsc.com/datasheet/PM2.54-1X8PM-H85/44458970.html; Supplier: LCSC; Holes Structure: 1x8P; Pitch: 2.54mm; Circular Hole / Square Hole: 方孔; Mounting Type: 直插; Number of Rows: 单排; Number of Positions: 8P; Current Rating: 3A; Holes Direction: 顶部; Insulation Height: 8.5mm; Contact Plating: 金; Operating Temperature: -40℃~+105℃
U7 = RT9013-33GB-MS_1: Supplier Part: C7434207; Manufacturer: MSKSEMI(美森科); Supplier Footprint: SOT-23-5; JLCPCB Part Class: 扩展库; Datasheet: https://atta.szlcsc.com/upload/public/pdf/source/20230705/1D6536D82D93AC1E044F3DAE104751D9.pdf; Supplier: LCSC; Output Type: 固定; Maximum Input Voltage: 5.5V; Output Voltage: 3.3V; MAX Output Current: 500mA; Power Supply Rejection Ratio (PSRR): 75dB@(1kHz); Output Polarity: 正极
U8 = BMI270: Supplier Part: C2836813; Manufacturer: Bosch(博世); Supplier Footprint: LGA-14(2.5x3); JLCPCB Part Class: 扩展库; Datasheet: https://atta.szlcsc.com/upload/public/pdf/source/20210625/C2836813_35E1F3F92097F45A3828DF13DDBA01A5.pdf; Supplier: LCSC; Sensor Type: 加速度计陀螺仪; Operating Temperature: -40℃~+85℃
U85 = HC-SHD-2*9PWT-G-04: 插针结构:2x9P;间距:1mm;安装方式:卧贴;参考系列:SHD;总PIN数:18P;排数:2;每排PIN数:9;行距:-;额定电流:1A;触头材质:磷青铜;触头镀层:金;工作温度范围:-25℃~+85℃;; LCSC Part Name: 2x9P 间距:1mm 卧贴 系列:SHD; Supplier Part: C5342462; Manufacturer: HCTL(华灿天禄); Supplier Footprint: SMD,P=1mm,卧贴; JLCPCB Part Class: 扩展库; Datasheet: https://atta.szlcsc.com/upload/public/pdf/source/20230104/D269C718AAB409966B71B4933E62C9A6.pdf; Supplier: LCSC; Pins Structure: 2x9P; Pitch: 1mm; Mounting Style: 卧贴; Reference Series: SHD; Number of Pins: 18P; Number of Rows: 2; Number of PINs Per Row: 9; Current Rating (Max): 1A; Contact Material: 磷青铜; Contact Plating: 金; Operating Temperature Range: -25℃~+85℃; Rated Voltage (Max): 50V; Supplementary Features: 辅助焊脚; Z-Height of the Board: 5.65mm; X-Length of Bottom Edge on Board (Spacing Line): 12.1mm; Y-Width of Bottom Edge on Board: 6.4mm
BUZZER1 = HNB09A05: 驱动方式:有源(内含驱动线路);构造类型:电磁式;额定电压:-;频率:3kHz;声压(SPL):85dB;; Supplier Part: C96493; Manufacturer: 华能; Supplier Footprint: 插件,D=9mm; JLCPCB Part Class: 扩展库; Datasheet: https://item.szlcsc.com/datasheet/HNB09A05/97698.html; Supplier: LCSC; Driver Circuitry: 有源(内含驱动线路); Technology: 电磁式; Voltage - Supply: 3V~7V; Sound Pressure Level(SPL): 85dB; Diameter(φD): 9mm; Height: 5.7mm
C11 C43 = CAP_604: Supplier Footprint: 0603
CN5 CN6 = WAFER-SH1.0-6PWB: 插针结构:1x6P;间距:1mm;安装方式:卧贴;参考系列:SH;总PIN数:6P;排数:1;每排PIN数:6;行距:-;额定电流:1A;触头材质:黄铜;触头镀层:锡;工作温度:-40℃~+85℃;; LCSC Part Name: 1x6P 间距:1mm 卧贴 系列:SH; Supplier Part: C3029345; Manufacturer: XUNPU(讯普); Supplier Footprint: SMD,P=1mm,卧贴; JLCPCB Part Class: 扩展库; Datasheet: https://item.szlcsc.com/datasheet/WAFER-SH1.0-6PWB/3561357.html; Supplier: LCSC; Pins Structure: 1x6P; Pitch: 1mm; Mounting Type: 卧贴; Reference Series: SH; Number of Pins: 6P; Number of Rows: 1; Number of PINs Per Row: 6; Current Rating: 1A; Contact Material: 黄铜; Contact Plating: 锡; Operating Temperature: -40℃~+85℃; Voltage Rating: 50V; Plastic Material: LCP; Supplementary Features: 辅助焊脚; Color: 米色; Z-Height of the Board: 3.15mm; X-Length of Bottom Edge on Board (Spacing Line): 8.35mm; Y-Width of Bottom Edge on Board: 4.3mm
FPC1 FPC2 = FPC-05F-18PH20: 锁定特性:翻盖式;触点类型:卧贴;触点数量:18P;间距:0.5mm;安装方式:下接;工作温度:-25℃~+85℃;; LCSC Part Name: 翻盖式 卧贴 P数:18P 间距:0.5mm; Supplier Part: C2856802; Manufacturer: XUNPU(讯普); Supplier Footprint: SMD,P=0.5mm,卧贴; JLCPCB Part Class: Extended Part; Datasheet: https://item.szlcsc.com/datasheet/FPC-05F-18PH20/3056900.html; Supplier: LCSC; Locking Feature: 翻盖式; Contact Type: 卧贴; Number of Contacts: 18P; Pitch: 0.5mm; Mounting Type: 下接; FFC, FCB Thickness: 0.3mm; Height Above Board: 2mm; Contact Material: 磷青铜; Contact Plating: 锡; Operating Temperature: -25℃~+85℃; Rated Voltage (Max): 50V; Current Rating (Max): 500mA
H5 = PZ254V-12-16P: 插针结构:2x8P;间距:2.54mm;行距:2.54mm;圆针/方针:方针;安装方式:直插;排数:双排;总PIN位数:16P;额定电流:-;额定电压:-;配合针长度:6mm;塑高:2.5mm;端接针长度:3mm;触头材质:黄铜;触头镀层:-;工作温度:-40℃~+105℃;颜色:黑色;; LCSC Part Name: 2x8P 间距:2.54mm 方针 直插; Supplier Part: C492425; Manufacturer: XFCN(兴飞); Supplier Footprint: 插件,P=2.54mm; JLCPCB Part Class: Extended Part; Datasheet: https://item.szlcsc.com/datasheet/PZ254V-12-16P/502981.html; Supplier: LCSC; Pin Structure: 2x8P; Pitch: 2.54mm; Row Spacing: 2.54mm; Circluar Pins/Square Pins: 方针; Mounting Type: 直插; Number of Rows: 双排; Number of Pins: 16P; Length of Mating Pin: 6mm; Insulation Height: 2.5mm; Length of End Connection Pin: 3mm; Contact Material: 黄铜; Operating Temperature: -40℃~+105℃; Color: 黑色
Q3 = S8050_C364312: 晶体管类型:NPN;集电极电流(Ic):500mA;集射极击穿电压(Vceo):25V;耗散功率(Pd):300mW;直流电流增益(hFE):-;; LCSC Part Name: hFE:200-350 NPN 电流:500mA 电压:25V; Supplier Part: C364312; Manufacturer: MDD(辰达半导体); Supplier Footprint: SOT-23; JLCPCB Part Class: 扩展库; Datasheet: https://item.szlcsc.com/datasheet/S8050/338624.html; Supplier: LCSC; type: NPN; Current - Collector(Ic): 500mA; Collector - Emitter Voltage VCEO: 25V; Pd - Power Dissipation: 300mW; Transition frequency(fT): 150MHz; Current - Collector Cutoff: 100nA; Vce Saturation(VCE(sat)): 600mV@500mA,50mA; Operating Temperature: -55℃~+150℃; Emitter-Base Voltage(Vebo): 5V
R57-R60 = 0603WAF1001T5E: 电阻类型:厚膜电阻;阻值:1kΩ;精度:±1%;功率:100mW;最大工作电压:75V;温度系数:±100ppm/℃;; LCSC Part Name: 1kΩ ±1% 100mW 厚膜电阻; Supplier Part: C21190; Manufacturer: UNI-ROYAL(厚声); Supplier Footprint: 0603; JLCPCB Part Class: 基础库; Datasheet: https://atta.szlcsc.com/upload/public/pdf/source/20200306/C422600_1E6D84923E4A46A82E41ADD87F860B5C.pdf; Supplier: LCSC; Type: 厚膜电阻; Tolerance: ±1%; Power(Watts): 100mW; Overload Voltage (Max): 75V; Temperature Coefficient: ±100ppm/℃; Operating Temperature Range: -55℃~+155℃; Resistance: 4.7k
SW1 = DSWB02LHGET: 类型:平拨,凸起式;电路结构:单刀单掷;开关位数:2位;工作寿命:-;颜色:红色;; LCSC Part Name: 拨码开关,平拨开关,DSWB02LHGET; Supplier Part: C99421; Manufacturer: YE; Supplier Footprint: 插件,P=2.54mm; JLCPCB Part Class: 扩展库; Datasheet: https://item.szlcsc.com/datasheet/DSWB02LHGET/100635.html; Supplier: LCSC; Type: 平拨,凸起式; Circuit: 单刀单掷; Number of Positions: 2位; Lead Pitch: 2.54mm; Color: 红色
SW8 = KAN0741-0601M1: LCSC Part Name: 五向开关,KAN0741-0601M1/102,贴片; Supplier Part: C231736; Manufacturer: GANGYUAN(港源); Supplier Footprint: SMD-8P,7.3x7.3mm; Datasheet: https://item.szlcsc.com/datasheet/KAN0741-0601M1/231562.html; Supplier: LCSC
U3 U24 = AL422B
U18 = SN74LVC1G00DCKR_C19829626: 逻辑类型:与非门;通道数:2;工作电压:1.65V~5.5V;静态电流(Iq):10uA;传播延迟(tpd):5.9ns@5V,15pF;; LCSC Part Name: 单路二输入与非门; Supplier Part: C19829626; Manufacturer: TECH PUBLIC(台舟); Supplier Footprint: SOT-353; JLCPCB Part Class: Extended Part; Datasheet: https://item.szlcsc.com/datasheet/SN74LVC1G00DCKR/21156921.html; Supplier: LCSC; Logic Type: 与非门; Number of Channels: 2; Voltage - Supply: 1.65V~5.5V; Quiescent Current: 10uA; Current - Output Low(IOL): 32mA; Current - Output High(IOH): 32mA; Input Logic Level - High: 2V；1.7V; Input Logic Level - Low: 800mV；700mV; Output Logic Level - High: 3.8V；1.9V；2.4V；2.3V；1.2V; Output Logic Level - Low: 300mV；400mV；450mV；550mV; Series: 74LVC; Propagation Delay: 5.9ns@5V,15pF; Operating Temperature: -40℃~+125℃; Input Number: 2
U19 U23 = 1.25-4PWB: 插针结构:1x4P;间距:1.25mm;安装方式:卧贴;参考系列:-;总PIN数:4P;排数:1;每排PIN数:4;行距:-;额定电流:-;工作温度范围:-40℃~+85℃;; LCSC Part Name: 1x4P 间距:1.25mm 卧贴; Supplier Part: C2905011; Manufacturer: DEALON(德艺隆); Supplier Footprint: SMD,P=1.25mm,卧贴; JLCPCB Part Class: 扩展库; Datasheet: https://atta.szlcsc.com/upload/public/pdf/source/20231123/1AE0876AE9C7DCFC0D68EAC4CBA881B0.pdf; Supplier: LCSC; Pins Structure: 1x4P; Pitch: 1.25mm; Mounting Style: 卧贴; Number of Pins: 4P; Number of Rows: 1; Number of PINs Per Row: 4; Operating Temperature Range: -40℃~+85℃
C18 C21 C25 C28 C44 C45 = C1206,22u,35V,X5R,20%: Supplier Part: C9900013881; Supplier Footprint: 1206; JLCPCB Part Class: Extended Part; Supplier: LCSC
C19 C20 C22 C26 C27 C29 C32 C33 C46-C48 C151 C153 = CC0603KRX7R9BB104: 容值:100nF;精度:±10%;额定电压:50V;材质(温度系数):X7R;; LCSC Part Name: 100nF ±10% 50V; Supplier Part: C14663; Manufacturer: YAGEO(国巨); Supplier Footprint: 0603; JLCPCB Part Class: 基础库; Datasheet: https://atta.szlcsc.com/upload/public/pdf/source/20180910/C282072_33301C7F631E79921B82A8DAC6BCC5B3.pdf; Supplier: LCSC; Tolerance: ±10%; Voltage Rated: 50V; Temperature Coefficient: X7R
C23 C30 C49 = PC0J561ME080Z25CR0: 容值:560uF;精度:±20%;额定电压:6.3V;; LCSC Part Name: 560uF ±20% 6.3V; Supplier Part: C240583; Manufacturer: HUAWEI(华威集团); Supplier Footprint: 插件,D6.3xL8mm; JLCPCB Part Class: 扩展库; Datasheet: https://atta.szlcsc.com/upload/public/pdf/source/20180730/C240602_49850D91CF8F2A983B901A3DA15D49BF.pdf; Supplier: LCSC; Tolerance: ±20%; Rated Voltage: 6.3V; Lead Spacing: 2.5mm; φD: 6.3mm; L: 8mm; Lifetime @ Temp: 5000hrs@105℃
C24 C31 C50 = HT1E107M0605PC: 容值:100uF;精度:±20%;额定电压:25V;纹波电流:850mA;等效串联电阻:55mΩ;; LCSC Part Name: 100uF ±20% 25V; Supplier Part: C5438660; Manufacturer: HONOR(荣誉); Supplier Footprint: 插件,D6.3xL5.5mm; JLCPCB Part Class: 扩展库; Datasheet: https://atta.szlcsc.com/upload/public/pdf/source/20230323/99CEEF301E75D54C6C0AC1BCAFD13AE7.pdf; Supplier: LCSC; Tolerance: ±20%; Rated Voltage: 25V; Ripple Current: 850mA; Equivalent Series Resistance(ESR): 55mΩ; Lead Spacing: 2.5mm; φD: 6.3mm; L: 5mm; Lifetime @ Temp: 2000hrs@125℃; Operating Temperature: -55℃~+125℃
C37 C38 = CAP_0805: Supplier Footprint: 0805
CN4 CN9 CN10 = XT30UPB-M: 类别:-;类型1:-;; LCSC Part Name: AMASS(艾迈斯)板载立式 航模锂电池控制器连接器插头 公头XT30UPB-M; Supplier Part: C428721; Manufacturer: AMASS(艾迈斯); JLCPCB Part Class: 扩展库; Datasheet: https://item.szlcsc.com/datasheet/XT30UPB-M/423831.html; Supplier: LCSC; Type: 航模插头; Colour: 黄色; RatedVoltage: DC 500V; InterfaceType: 公头; MetalMaterial: 镀金; InsulationMaterial: PA; RatedCurrent: 15A; contact resistance: 0.65mΩ
D1 = BZT52C16_C173426: 二极管配置:独立式;稳压值(标称值):16V;稳压值(范围):15.3V~17.1V;精度:-;功率:500mW;反向电流(Ir):100nA@11.2V;阻抗(Zzt):40Ω;; LCSC Part Name: 16V 500mW; Supplier Part: C173426; Manufacturer: MDD; Supplier Footprint: SOD-123; JLCPCB Part Class: Extended Part; Datasheet: https://atta.szlcsc.com/upload/public/pdf/source/20180207/C173426_15179895458921356272.pdf; Supplier: LCSC; Diode Configuration: 独立式; Zener Voltage (Nom): 16V; Zener Voltage (Range): 15.3V~17.1V; Power Dissipation: 500mW; Reverse Leakage Current (Ir): 100nA@11.2V; Zener Impedance (Zzt): 40Ω
D2-D7 = SS54_C22452: 正向压降(Vf):550mV@5A;直流反向耐压(Vr):40V;平均整流电流(Io):5A;; LCSC Part Name: 电压:40V 电流:5A; Supplier Part: C22452; Manufacturer: MDD; Supplier Footprint: SMA(DO-214AC); JLCPCB Part Class: Basic Part; Datasheet: https://atta.szlcsc.com/upload/public/pdf/source/20230314/529CD85F9B31F69841D3A079BC07E377.pdf; Supplier: LCSC; Forward Voltage (Vf@If): 550mV@5A; Reverse Voltage (Vr): 40V; Average Rectified Current (Io): 5A; Reverse Leakage Current (Ir): 1mA@40V
L1 = FXL0530-100-M: 电感值:10uH;精度:±20%;额定电流:3.2A;饱和电流(Isat):3.5A;类型:一体成型电感;; LCSC Part Name: 10uH ±20% 3.5A; Supplier Part: C177248; Manufacturer: cjiang(长江微电); Supplier Footprint: SMD,5.4x5.2mm; JLCPCB Part Class: 扩展库; Datasheet: https://item.szlcsc.com/datasheet/FXL0530-100-M/188640.html; Supplier: LCSC; Tolerance: ±20%; Current Rating: 3.2A; Current - Saturation(Isat): 3.5A; DC Resistance(DCR): 125mΩ; Type: 一体成型电感
Q2 = AGM30P100A: 数量:1个P沟道;漏源电压(Vdss):30V;连续漏极电流(Id):118A;导通电阻(RDS(on)):3.7mΩ@10V；5.6mΩ@4.5V;耗散功率(Pd):100W;阈值电压(Vgs(th)):1.6V@250uA;; LCSC Part Name: 1个P沟道 耐压:30V 电流:118A; Supplier Part: C5297493; Manufacturer: AGMSEMI(芯控源); Supplier Footprint: PDFN5x6-8L; JLCPCB Part Class: 扩展库; Datasheet: https://item.szlcsc.com/datasheet/AGM30P100A/6044633.html; Supplier: LCSC; Number: 1个P沟道; Drain to Source Voltage: 30V; Current - Continuous Drain(Id): 118A; RDS(on): 3.7mΩ@10V；5.6mΩ@4.5V; Pd - Power Dissipation: 100W; Gate Threshold Voltage (Vgs(th)): 1.6V@250uA; Gate Charge(Qg): 122nC@10V; Input Capacitance(Ciss): 5.7nF@15V; Reverse Transfer Capacitance (Crss@Vds): 755pF@15V; Operating Temperature: -55℃~+150℃
R26 = RC0603FR-074K7L: 阻值:4.7kΩ;精度:±1%;功率:100mW;温度系数:±100ppm/℃;最大工作电压:75V;工作温度范围:-55℃~+155℃;; LCSC Part Name: 4.7kΩ ±1% 100mW; Supplier Part: C99782; Manufacturer: YAGEO(国巨); Supplier Footprint: 0603; JLCPCB Part Class: Extended Part; Datasheet: https://atta.szlcsc.com/upload/public/pdf/source/20171030/C99782_15093665213961068236.pdf; Supplier: LCSC; Tolerance: ±1%; Power(Watts): 100mW; Temperature Coefficient: ±100ppm/℃; Overload Voltage (Max): 75V; Operating Temperature Range: -55℃~+155℃
U6 = ST-0-102-A01-T000-LF+PJ: 额定电流:3A;额定电压(AC):125V;电路结构:单刀双掷;机械寿命:-;安装方式:直插;; LCSC Part Name: 超小型钮子三脚二档(五件套); Supplier Part: C1788487; Manufacturer: YUEN FUNG(源丰); Supplier Footprint: 插件; JLCPCB Part Class: Extended Part; Datasheet: https://atta.szlcsc.com/upload/public/pdf/source/20201225/C1788487_ABF23CBC69324BAB5097CA9AB4E08B0E.pdf; Supplier: LCSC; Contact Current: 3A; Voltage Rating (AC): 125V; Circuit: 单刀双掷; Actuator Type: 圆柱钮柄; Pin Style: 焊片; Mounting Style: 直插; Operating Temperature: -25℃~+85℃; Switch Length: 8.3mm; Switch Width: 5.2mm; Switch Height: 23.6mm
U9 U11 U20 = SCT2450CSTER: Supplier Part: C2830168; Manufacturer: SCT(芯洲科技); Supplier Footprint: ESOP-8; JLCPCB Part Class: Extended Part; Datasheet: https://atta.szlcsc.com/upload/public/pdf/source/20210427/C2830168_B41A77C8AB112793365934791D75263F.pdf; Supplier: LCSC
U10 U12 U21 = FXL0530-4R7-M: 电感值:4.7uH;精度:±20%;额定电流:4.5A;饱和电流(Isat):5A;类型:一体成型电感;; LCSC Part Name: 4.7uH ±20% 5A; Supplier Part: C177246; Manufacturer: cjiang(长江微电); Supplier Footprint: SMD,5.2x5.4mm; JLCPCB Part Class: 扩展库; Datasheet: https://atta.szlcsc.com/upload/public/pdf/source/20230516/4BF6F9C76E81720F52A39ED5FFFA18B4.pdf; Supplier: LCSC; Tolerance: ±20%; Rated Current: 4.5A; Saturation Current (Isat): 5A; DC Resistance (DCR): 60mΩ; Type: 一体成型电感
U13 = RT9013-33GB-MS: 输出类型:固定;最大输入电压:5.5V;输出电压:3.3V;最大输出电流:500mA;电源纹波抑制比(PSRR):75dB@(1kHz);输出极性:正极;; Supplier Part: C7434207; Manufacturer: MSKSEMI(美森科); Supplier Footprint: SOT-23-5; JLCPCB Part Class: Extended Part; Datasheet: https://atta.szlcsc.com/upload/public/pdf/source/20230705/1D6536D82D93AC1E044F3DAE104751D9.pdf; Supplier: LCSC; Output Type: 固定; Maximum Input Voltage: 5.5V; Output Voltage: 3.3V; MAX Output Current: 500mA; Power Supply Rejection Ratio (PSRR): 75dB@(1kHz); Output Polarity: 正极
U15 U16 = KM477M025F12RR0VH2FP0: 容值:470uF;精度:±20%;额定电压:25V;; LCSC Part Name: 470uF ±20% 25V; Supplier Part: C43839; Manufacturer: CX(承兴); Supplier Footprint: 插件,D8xL12mm; JLCPCB Part Class: 扩展库; Datasheet: https://atta.szlcsc.com/upload/public/pdf/source/20211027/06D6BA3719C264B639DC286D935D03EA.pdf; Supplier: LCSC; Tolerance: ±20%; Rated Voltage: 25V; φD: 8mm; L: 12mm; Lead Spacing: 3.5mm; Lifetime @ Temp: 2000hrs@105℃
U17 = TPS54302DDCR: 功能类型:降压型;输出类型:固定;工作电压:4.5V~28V;输出电压:5V;输出电流:3A;; LCSC Part Name: 4.5V至28V输入、3A输出、EMI友好的同步降压转换器; Supplier Part: C311983; Manufacturer: TI(德州仪器); Supplier Footprint: TSOT-23-6; JLCPCB Part Class: 扩展库; Datasheet: https://www.ti.com/cn/lit/gpn/tps54302; Supplier: LCSC; Function: 降压型; Output Type: 固定; Input Voltage: 4.5V~28V; Output Voltage: 5V; Output Current: 3A; Switching Frequency: 400kHz; Operating Temperature: -40℃~+125℃; Synchronous Rectification: 是; Number of Outputs: 1; Topology: 降压式; Quiescent Current (Iq): 45uA; Switch tube (built-in/external): 内置

## Nets
3.3V: C15.2 C16.1 C17.2 C40.1 R24.1 RN1.5 RN1.6 RN1.7 RN1.8 U7.5(VOUT) U8.5(VDDIO) U8.8(VDD)
3V3: FPC1.17 FPC1.18
5V_CORE: C34.2 C35.2 C39.2 C152.1 CN5.1 CN6.1 L1.1 P2.4 R38.2 SW44.1 USB1.2(VBUS) USB1.11(VBUS)
7V4: D5.2(K) H7.8 R35.1
AGND: C1.1 C2.1 C3.1 C4.1 C5.2 C6.2 C7.1 C8.2 C9.2 C10.1 C11.1 C12.1 C13.1 C14.1 C15.1 C16.2 C17.1 C32.1 C33.1 C40.2 C41.2 C42.2 C43.1 C107.1 C111.1 C112.2 C113.1 C151.1 C152.2 C153.1 FPC1.2 FPC1.7 FPC1.16 FPC1.19 FPC1.20 FPC2.2 FPC2.7 FPC2.16 FPC2.19 FPC2.20 H1.2 H2.7 H2.8 H4.3 H5.4 H5.14 H6.3 H6.4 H8.15 H10.2 H11.6 H12.6 H13.1 H14.1 H15.3 H15.4 H16.3 H16.4 P2.3 Q1.2(S) Q3.2(E) Q4.2(S) Q5.2(S) Q6.2(S) Q7.2(S) R2.1 R3.1 R4.1 R6.1 R14.1 R17.1 R24.2 R33.1 R34.1 R44.2 R51.2 R53.1 R69.1 R70.2 R72.2 R73.1 R74.1 R75.1 R76.1 R77.1 R78.1 R79.1 R81.2 R83.2 R92.1 R193.1 SW1.3 SW1.4 SW2.2 SW3.2 SW4.2 SW5.2 SW6.2 SW8.5(COM) SW31.3 SW31.4 SW45.3 SW45.4 U1.25(ADC_VRef-/ADC_AGnd) U1.30(Gnd) U2.8 U3.6(GND1) U3.7(TST) U3.23(GND2) U3.24(RE) U7.2(GND) U8.6(GNDIO) U8.7(GND) U13.2(GND) U18.3(GND) U19.1 U23.1 U85.9 USB1.1(GND) USB1.12(GND) USB1.13(SHELL) USB1.14(SHELL) X1.2(GND) X1.4(GND)
GND: C18.2 C19.1 C21.2 C22.2 C23.2 C24.2 C25.2 C26.1 C28.2 C29.2 C30.2 C31.2 C34.1 C35.1 C37.1 C38.1 C39.1 C44.2 C45.2 C46.1 C48.2 C49.2 C50.2 CN4.1(-) CN5.6 CN6.6 CN9.1(-) CN10.1(-) H3.1 H7.1 H7.4 H7.7 H9.1 R17.2 R26.1 R27.1 R32.2 R37.2 R39.1 R55.1 R64.1 R68.2 R92.2 R193.2 U9.7(GND) U9.9(EP) U11.7(GND) U11.9(EP) U15.2 U16.2 U17.1(GND) U20.7(GND) U20.9(EP)
VCC3V3: 3V1.2(A) 3V2.2(A) C10.2 C11.2 C33.2 C151.2 H5.16 R16.1 R19.1 R47.1 R48.1 R49.1 U3.10(VDD) U3.19(DEC) U13.5(VOUT) U18.5(VCC) U85.13
VCC7.4: 7V1.2(A) D7.2(K) H3.2 R66.1
VCC7.4V: 7V4.2(A) D3.2(K) H7.2 H7.5 H9.2 R30.1
VCCAM: C43.2 FPC2.17 FPC2.18
VCCBAT: C37.2 C38.2 CN9.2(+) CN10.2(+) D2.1(A) D4.1(A) D6.1(A) Q2.5(D) Q2.6(D) Q2.7(D) Q2.8(D) Q2.9(D) R43.2 U15.1 U16.1 U17.3(VIN)
VCCIC: 3V3.2(A) C3.2 C4.2 C5.1 C6.1 C8.1 C9.1 C12.2 C13.2 C32.2 C41.1 C42.1 C153.2 H1.1 H2.9 H4.4 H8.13 H10.1 H11.5 H12.5 H13.2 H14.2 R1.1 R12.2 R23.1 R29.1 R40.1 R57.1 R58.1 R59.1 R60.1 SW44.2 U1.28(Vcc/ADC_AVcc) U1.44(Vcc) U1.67(Vcc) U2.7 U7.1(VIN) U7.3(CE) U13.1(VIN) U13.3(CE) U19.2 U23.2 U85.8 芯片1.2(A)
0.0: U1.95(CAN_RX/OPA1O_2/OPA2O_2/PWMB5_3/RXD3/T3_2/ADCB0/ADC8/AD0/P0.0)
0.4: H4.1 U1.99(OPA1+_1/OPA1-_2/PWMA_E1_2/MISO2_2/T3/ADCB4/AD4/P0.4)
0.5: H4.2 U1.2(P0.5/AD5/ADCB5/T3CLKO/SCLK2_2/PWMA_E2_2/OPA1-_1/OPA1+)
0.6: U1.3(P0.6/AD6/ADCB6/T4/PWMB_ETR_2/LIN2_RX)
0.7: U1.4(P0.7/AD7/ADCB7/T4CLKO/PWMB_BRK_2/OPA1O_1/LIN2_TX)
1.0: C14.2 R43.1 R44.1 U1.18(P1.0/ADCO/RXD2/PWMAIP/CMP2+_2/OSPI1_IO3)
1.5: H2.6 U1.22(P1.5/ADC5/2CSCL/SCLK/PWMA_E2_4/PWMA3N/OSPI1_CLK)
2.0: U1.72(OPA3+_2/PWMB5/PWMA1P_2/A8/P2.0) U3.28(DO0)
2.1: U1.73(OPA3O_2/PWMB6/PWMAIN_2/A9/P2.1) U3.27(DO1)
2.2: U1.74(I2S_LRCK_3/PWMB7/PWMA2P_2/SS_2/A10/P2.2) U3.26(DO2)
2.3: U1.75(I2S_Data_3/PWMB8/PWMA2N_2/MOSI_2/A11/P2.3) U3.25(DO3)
2.4: U1.76(I2S_MCK_3/CMP30_1PWMA3P_2/2CSDA_2/MISO_2/A12/P2.4) U3.18(DO4)
2.5: U1.77(I2S_BCK_3/CMP40_1/PWMA3N_2/2CSCL_2/SCLK_2/A13/P2.5) U3.17(DO5)
2.6: U1.78(LIN2_RX_2/OPA2+_1/CMP4-_1/PWMA4P_2/A14/P2.6) U3.16(DO6)
2.7: U1.79(LIN2_TX_2/OPA2-_1/CMP4+_1/PWMA4N_2/A15/P2.7) U3.15(DO7)
3.3: FPC2.6 H5.12 U1.48(P3.3/INT1/MISO_4/2CSDA_4/PWMA4N_4/PWMB7_2/OPA4-_3/2S_MCK)
3.4: H1.6 RN1.1 U1.49(P3.4/T0/TICLKO/MOSI_4/PWMA4P_4/PWMB8_2/CMP1O_1/I2S_Data) U8.12(CSB)
3.5: H8.3 U1.52(2S_LRCK/OPA3+_1/PWMB_BRK/WMA_BRK/SS_4/T0CLKO/T1/P3.5) U2.2 U85.3
3.6: H1.8 U1.53(CMP1-_1/INT2/RXD_2/P3.6)
3.7: U1.54(CMP1+_1/NT3/TXD_2/P3.7) U3.20(RCLK)
4.0: H12.4 U1.31(P4.0/MOSI_3/CMP2O_2/OPA4O_2/QSPI1_IO0_2/2S_Data_4)
4.1: U1.68(2S_LRCK_4/QSPI1_IO1_2/CMP1O_2/PWMA_ETR_2/MISO_3/P4.1) U18.1(A)
4.2: H12.3 U1.69(CAN_RX_3/OPA3-_2/OPA20_1/WR/P4.2)
4.3: U1.70(2S_BCK_4/QSPI1_CLK_2/CMP4+_2/SCLK_3/RXD_4/ADCB_ETR_2/ADC_ETR_2/P4.3) U3.21(RRST)
4.4: 3V4.2(A) H13.4 R5.1 U1.71(CMP4-_2/TXD_4/RD/P4.4)
4.6: H14.4 U1.94(QSPI1_IO2_2/CAN2_RX_3/LIN_RX_3/CMP4O_2/PWMA_E1RXD2_2/P4.6)
4.7: H2.10 U1.20(P4.7/TXD2_2/PWMA_E2/CMP2O_1/LIN_TX_3/CAN2_TX_3/OSPI1_I03_2)
5.0: 3V8.2(A) R82.1 U1.50(P5.0/RXD3_2/CMP1+_2/OPA3O_4/CAN_RX2)
5.1: 3V5.2(A) R80.1 U1.51(CAN_TX_2/OPA3-_1/CMP1-_2/TXD3_2/P5.1)
5.2: 9.1.2(A) U1.100(CAN2_RX_2/LIN_RX_2/CMP3-_2/RXD4_2/P5.2)
5.3: 9.7.2(A) U1.1(P5.3/CAN2_TX_2/LIN_TX_2/CMP3+_2/TXD4_2)
6.0: H11.4 U1.5(P6.0/ADCB8/PWMA1P_3/OPA2+_2/OPA1+_3)
6.1: H10.3 U1.6(P6.1/ADCB9/PWMAIN_3/OPA2-_2/OPA1-_3)
6.2: H11.3 U1.7(P6.2/ADCB10/PWMA2P_3/OPA20_4/LIN2_RX_3)
6.3: H10.4 U1.8(P6.3/PWMA2N_3/OPA4O_4/OPA4+_2/OPA1O_4/LIN2_TX_3)
6.4: H2.4 U1.32(P6.4/SS2/PWMA3P_3/OPA4+_3/2S_Data_2)
6.5: R53.2 U1.33(P6.5/MOSI2/WMA3N_3/OPA4-_2/2S_LRCK_2)
6.6: H10.5 U1.34(P6.6/MISO2/PWMA4P_3/CMP2-_1/2S_BCK_2)
6.7: 3V7.2(A) R71.1 U1.35(P6.7/SCLK2/PWMA4N_3/CMP2+_1/2S_MCK_2)
7.0: H8.7 U1.55(OSPI1_IO0_3/CAN_RX_4/OPA3+_3/P7.0) U2.4 U85.5
7.1: H8.5 U1.56(OSPI1_CLK_3/CAN_TX_4/OPA3-_3/P7.1) U2.3 U85.4
7.2: U1.57(OSPI1_IO1_3/CAN2_RX_4/LIN_RX_4/PWMA_E1_3/P7.2) U3.22(OE)
7.3: U1.58(QSPI1_IO2_3/CAN2_TX_4/LIN_TX_4/PWMA_E2_3/PWMA_ETR_3/P7.3) U3.8(WRST)
7.4: H15.1 U1.80(QSPI1_IO3_3/OPA1O_3/OPA2O_3/OPA3O_3/OPA4O_3/PWMB5_4/P7.4)
7.5: H15.5 U1.81(QSPI1_NCS_3/OPA2+_3/PWMB6_4/P7.5)
7.6: H15.2 U1.82(OPA2-_3/CMP3-_1/PWMB7_4/2CSDA_3/P7.6)
7.7: H15.6 U1.83(OPA2+_4/CMP3+_1/PWMB8_4/2CSCL_3/P7.7)
8.0: H13.3 U1.9(P8.0/SS2_4)
8.1: H2.5 H8.9 U1.10(P8.1/MOSI2_4) U2.5 U85.6
8.2: H2.1 H8.1 U1.11(P8.2/MISO2_4) U2.1 U85.2
8.3: H2.3 H8.11 U1.12(P8.3/SCLK2_4) U2.6 U85.7
8.4: H10.6 U1.13(P8.4/RXD2_3/LIN2_RX_4)
8.5: H1.4 RN1.3 U1.14(P8.5/TXD2_3/LIN2_TX_4) U8.14(SDX)
8.6: H1.5 R25.2 RN1.4 U1.15(P8.6/RXD3_3)
8.7: H1.3 RN1.2 U1.16(P8.7/TXD3_3) U8.13(SCX)
9.0: H14.3 R41.2 U1.36(P9.0/)
9.1: R42.2 U1.37(P9.1/)
9.2: R54.2 SW8.1(A) U1.38(P9.2/) U85.18
9.3: R7.2 SW8.2(E) U1.39(P9.3/) U85.17
9.4: R8.2 SW8.3(C) U1.40(P9.4/) U85.16
9.5: R9.2 SW8.4(B) U1.41(P9.5/) U85.15
9.6: R10.2 SW8.6(D) U1.42(P9.6/) U85.14
9.7: 3V6.2(A) R50.1 U1.43(P9.7/)
A.0: R46.2 U1.59(RXD2_4/PA.0)
A.1: R21.2 U1.60(TXD2_4/PA.1)
A.2: R61.2 U1.61(RXD4_3/PA.2)
A.3: R22.2 U1.62(TXD4_3/PA.3)
A.5: R62.2 U1.64(S8MOSI_2/PA.5)
A.7: R63.2 U1.66(S8SCLK_2/PA.7)
B.6: FPC2.4 H5.6 U1.90(RXD3_4/PB.6)
B.7: FPC2.3 H5.8 U1.91(TXD3_4/PB.7)
CC1: R4.2 USB1.4(CC1)
CC2: R14.2 USB1.10(CC2)
CORE_VCC: C1.2 C111.2 U1.17(Core_Vcc) U1.92(Core_Vcc)
CS2: CN5.5
CS3: CN6.5 R60.2 U23.3
D1: FPC1.8
D2: FPC1.9
D3: FPC1.10
D4: FPC1.11
D5: FPC1.12
D6: FPC1.13
D7: FPC1.14
D8: FPC1.15
D+: P2.2 R15.1 USB1.6(DP1) USB1.8(DP2)
D-: P2.1 R11.1 USB1.5(DN2) USB1.7(DN1)
FB3: R38.1 R39.2 U17.4(FB)
HREF: FPC1.5 FPC2.5 H5.10 U18.2(B)
INT2: U8.9(INT2)
MISO2: CN5.4
MISO3: CN6.4 R58.2 U19.3
MOSI2: CN5.3
MOSI3: CN6.3 R59.2 U23.4
P1.6: C113.2 U1.23(P1.6/ADC6/RXD_3/MCLKO_2/XTALO/PWMA4P/OPA4+_1/I2S_MCK_4) X1.3(OSC2)
P1.7: C112.1 U1.24(P1.7/ADCT/XTALITXD_3/PWMA4N/PWM/OPA4+_1/I2S_MCK_4||P1.3/ADC3/T2CLKO/MOSI/PWMA_E1_4/PWMA2N/OPA4O_1/OSPI1_IO0) X1.1(OSC1)
P3.0: R11.2 U1.45(P3.0/RXD/INT4/D-)
P3.1: R15.2 U1.46(P3.1/TXD/D+)
P3.2: R12.1 R13.2 U1.47(P3.2/INT0/SCLK_4/2CSCL_4/PWMA_ETR/PWMB_ETR/OPA3O_1/2S_BCK)
P3.3: FPC1.6
P4.3: R20.2
P4.5: R18.2
P4.6: R45.2
P5.4: C107.2 R29.2 SW31.1 SW31.2 U1.27(P5.4/RST/MCLKO/SS_3/PWMB6_2/QSPI1_NCS_2)
P8.3: CN6.2 R57.2 U19.4
P8.7: CN5.2
PCLK: FPC1.1 FPC2.1 H5.2 U3.9(WCLK)
RXD: FPC1.4
TXD: FPC1.3
UCAP: C7.2 U1.26(UCap)
VREF: C2.2 U1.29(ADC_AVRef+)
WE: U3.5(WE) U18.4(Y)
$1N37511: R13.1 SW45.1 SW45.2
$2N8: C36.2 U17.6(BOOT)
$2N11: C36.1 L1.2 U17.2(SW)
$2N35: R30.2 R31.1
$2N37: C22.1 R28.2
$2N38: C21.1 C23.1 D3.1(A) U10.2
$2N39: C20.1 U9.8(SW) U10.1
$2N40: R28.1 U9.6(COMP)
$2N41: R31.2 R32.1 U9.5(FB)
$2N42: R27.2 U9.4(RT/CLK)
$2N43: C20.2 U9.1(BOOT)
$2N45: C18.1 C19.2 C24.1 D2.2(K) U9.2(VIN) U9.3(EN)
$2N48: CN4.2(+) D1.1(K) Q2.1(S) Q2.2(S) Q2.3(S) U6.1
$2N49: D1.2(A) R26.2 U6.3
$2N1711: R66.2 R67.1
$2N1712: R65.1 U20.6(COMP)
$2N1713: R67.2 R68.1 U20.5(FB)
$2N1714: R64.2 U20.4(RT/CLK)
$2N1715: C48.1 R65.2
$2N1716: C47.2 U20.1(BOOT)
$2N1717: C47.1 U20.8(SW) U21.1
$2N1719: C45.1 C49.1 D7.1(A) U21.2
$2N1720: C44.1 C46.2 C50.1 D6.2(K) U20.2(VIN) U20.3(EN)
$2N1728: Q2.4(G) U6.2
$3N54: CN1.2 Q1.3(D)
$3N132: Q1.1(G) R50.2 R51.1
$3N199: CN7.2 Q4.3(D)
$3N202: Q4.1(G) R80.2 R81.1
$3N204: CN8.2 Q5.3(D)
$3N207: Q5.1(G) R82.2 R83.1
$3N307: CN2.2 Q6.3(D)
$3N309: Q6.1(G) R5.2 R70.1
$3N312: CN3.2 Q7.3(D)
$3N314: Q7.1(G) R71.2 R72.1
$3N325: 3V4.1(C) R75.2
$3N327: 3V7.1(C) R76.2
$3N329: 3V8.1(C) R77.2
$3N331: 3V5.1(C) R78.2
$3N333: 3V6.1(C) R79.2
$4N50: R40.2 R42.1 SW1.2
$4N51: R23.2 R41.1 SW1.1
$4N55: Q3.1(B) R52.2
Net-(3V1-1): 3V1.1(C) R3.2
Net-(3V2-1): 3V2.1(C) R34.2
Net-(3V3-1): 3V3.1(C) R33.2
Net-(7V1-1): 7V1.1(C) R69.2
Net-(7V4-1): 7V4.1(C) R2.2
Net-(9.1-1): 9.1.1(C) R74.2
Net-(9.7-1): 9.7.1(C) R73.2
Net-(C25-1): C25.1 C26.2 C31.1 D4.2(K) U11.2(VIN) U11.3(EN)
Net-(C27-1): C27.1 U11.8(SW) U12.1
Net-(C27-2): C27.2 U11.1(BOOT)
Net-(C28-1): C28.1 C30.1 D5.1(A) U12.2
Net-(C29-1): C29.1 R56.2
Net-(H3-3): H3.3 R61.1
Net-(H5-1): H5.1 U3.1(DI0)
Net-(H5-3): H5.3 U3.2(DI1)
Net-(H5-5): H5.5 U3.3(DI2)
Net-(H5-7): H5.7 U3.4(DI3)
Net-(H5-9): H5.9 U3.11(DI4)
Net-(H5-11): H5.11 U3.12(DI5)
Net-(H5-13): H5.13 U3.13(DI6)
Net-(H5-15): H5.15 U3.14(DI7)
Net-(H6-1): H6.1 R62.1
Net-(H6-2): H6.2 R63.1
Net-(H7-3): H7.3 R20.1
Net-(H7-6): H7.6 R18.1
Net-(H7-9): H7.9 R45.1
Net-(H9-3): H9.3 R46.1
Net-(H16-1): H16.1 R21.1
Net-(H16-2): H16.2 R22.1
Net-(R6-2): R6.2 芯片1.1(C)
Net-(R7-1): R7.1 R48.2 SW4.1
Net-(R8-1): R8.1 R19.2 SW3.1
Net-(R9-1): R9.1 R47.2 SW2.1
Net-(R10-1): R10.1 R16.2 SW6.1
Net-(R25-1): R25.1 U8.1(SDO)
Net-(R35-2): R35.2 R36.1
Net-(R36-2): R36.2 R37.1 U11.5(FB)
Net-(R49-2): R49.2 R54.1 SW5.1
Net-(R55-2): R55.2 U11.4(RT/CLK)
Net-(R56-1): R56.1 U11.6(COMP)

Not connected (* = marked no-connect by the designer): BUZZER1 1(+) 2; CN1 1; CN2 1; CN3 1; CN5 7 8; CN6 7 8; CN7 1; CN8 1; FPC2 8 9 10 11 12 13 14 15; H1 7*; H2 2*; H8 2 4 6 8 10 12 14 16; H11 1* 2*; H12 1* 2*; H13 5* 6*; H14 5* 6*; Q3 3(C); R1 2; R52 1; SCREW1 1; SCREW2 1; SCREW3 1; SCREW4 1; SW8 7 8; U1 19(P1.1/ADC1/TXD2/PWMA1N/CMP2-_2/OSPI1_IO2) 21(P1.4/ADC4/MISO/2CSDA/PWMA3P/OSPI1_IO1) 63(S8SS_2/PA.4) 65(S8MISO_2/PA.6) 84(/PB.0) 85(SS2_3/PB.1) 86(MOSI2_3/PB.2) 87(MISO2_3/PB.3) 88(SCLK2_3/PB.4) 89(/PB.5) 93(CAN_TX_3/CMP3O_2/PWMA_BRK_2/ALE/P4.5) 96(CAN_TX/PWMB6_3/TXD3/T3CLKO_2/ADCB1/ADC9/AD1/P0.1) 97(CAN2_RXLIN_RXPWMB7_3/SS2_2/RXD4/T4_2/ADCB2/ADC10/AD2/P0.2) 98(CAN2_TX/LIN_TX/PWMB8_3/MOSI2_2/TXD4/T4CLKO_2/ADCB3/AD3/P0.3); U4 1 2 3 4; U7 4(NC)*; U8 2(ASDX)* 3(ASCX)* 4(INT1)* 10(OCSB) 11(OSDO)*; U13 4(NC)*; U17 5(EN)*; U19 5 6; U23 5 6; U24 1(DI0) 2(DI1) 3(DI2) 4(DI3) 5(WE) 6(GND1) 7(TST) 8(WRST) 9(WCLK) 10(VDD) 11(DI4) 12(DI5) 13(DI6) 14(DI7) 15(DO7) 16(DO6) 17(DO5) 18(DO4) 19(DEC) 20(RCLK) 21(RRST) 22(OE) 23(GND2) 24(RE) 25(DO3) 26(DO2) 27(DO1) 28(DO0); U85 1 10 11 12 19 20; USB1 3(SBU2)* 9(SBU1)*

## Notes on the sheets
sheet 1
- MCU
- 串口烧录USART1
- 复位按键
- 外部晶振
- 定位孔
sheet 2
- 电源接口\开关
- 芯片电源
- VOUT=VREF*(1+R2/R3)
- VREF=0.6V
- 7.4V电源模块
- 舵机电源模块
- 62k
- 13k
- 3V3电源模块\摄像头电源
- 电机电源接口
sheet 3
- 陀螺仪SPI
- 屏幕接口
- 蓝牙串口拓展
- 电调接口/涵道
- 恒温电阻
- 无线spi
- SDA/SDI
- SAO/SDO
- CS
- SCL/SPC
- INT1：中断源
- INT2：中断源
- TOF模块接口
- 舵机PWMF
- 编码器接口
- 激光
- 激光
- 有刷电机接口
- 660
- 陀螺仪SPI
- 激光
- 激光
- 激光
sheet 4
- 摄像头
- FIFO模块
- 按键模块
- 电池电压检测
- LED
- 蜂鸣器
- 无配置
- 磁编1复用USART5_SPI
- 驱动磁编
- 磁编2
- SPI
- 无配置
- 无配置
